# EAGLE board atari_superxe_motherboard (EAGLE 7.2.0), part 1 of 3
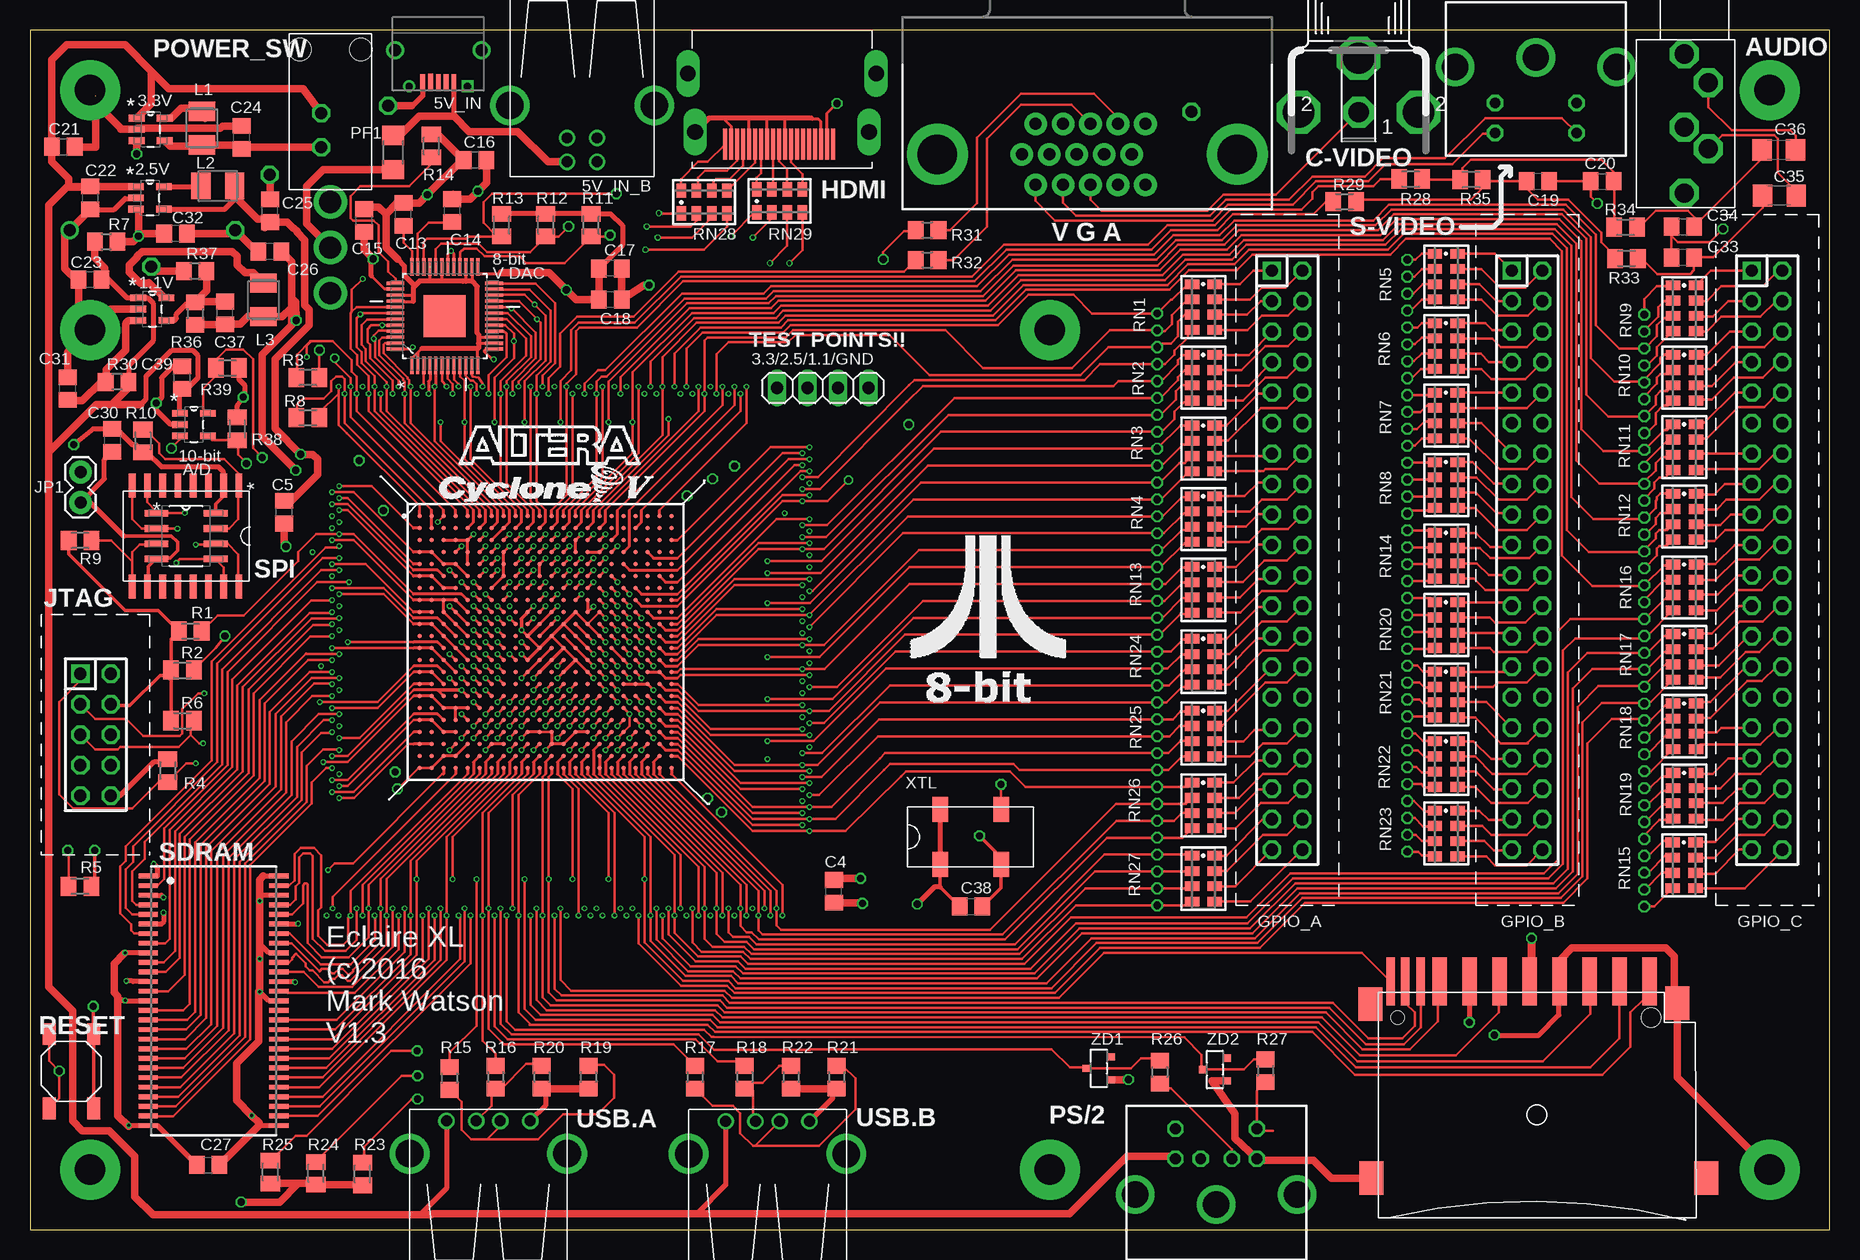
[diagram p12: board, top side]
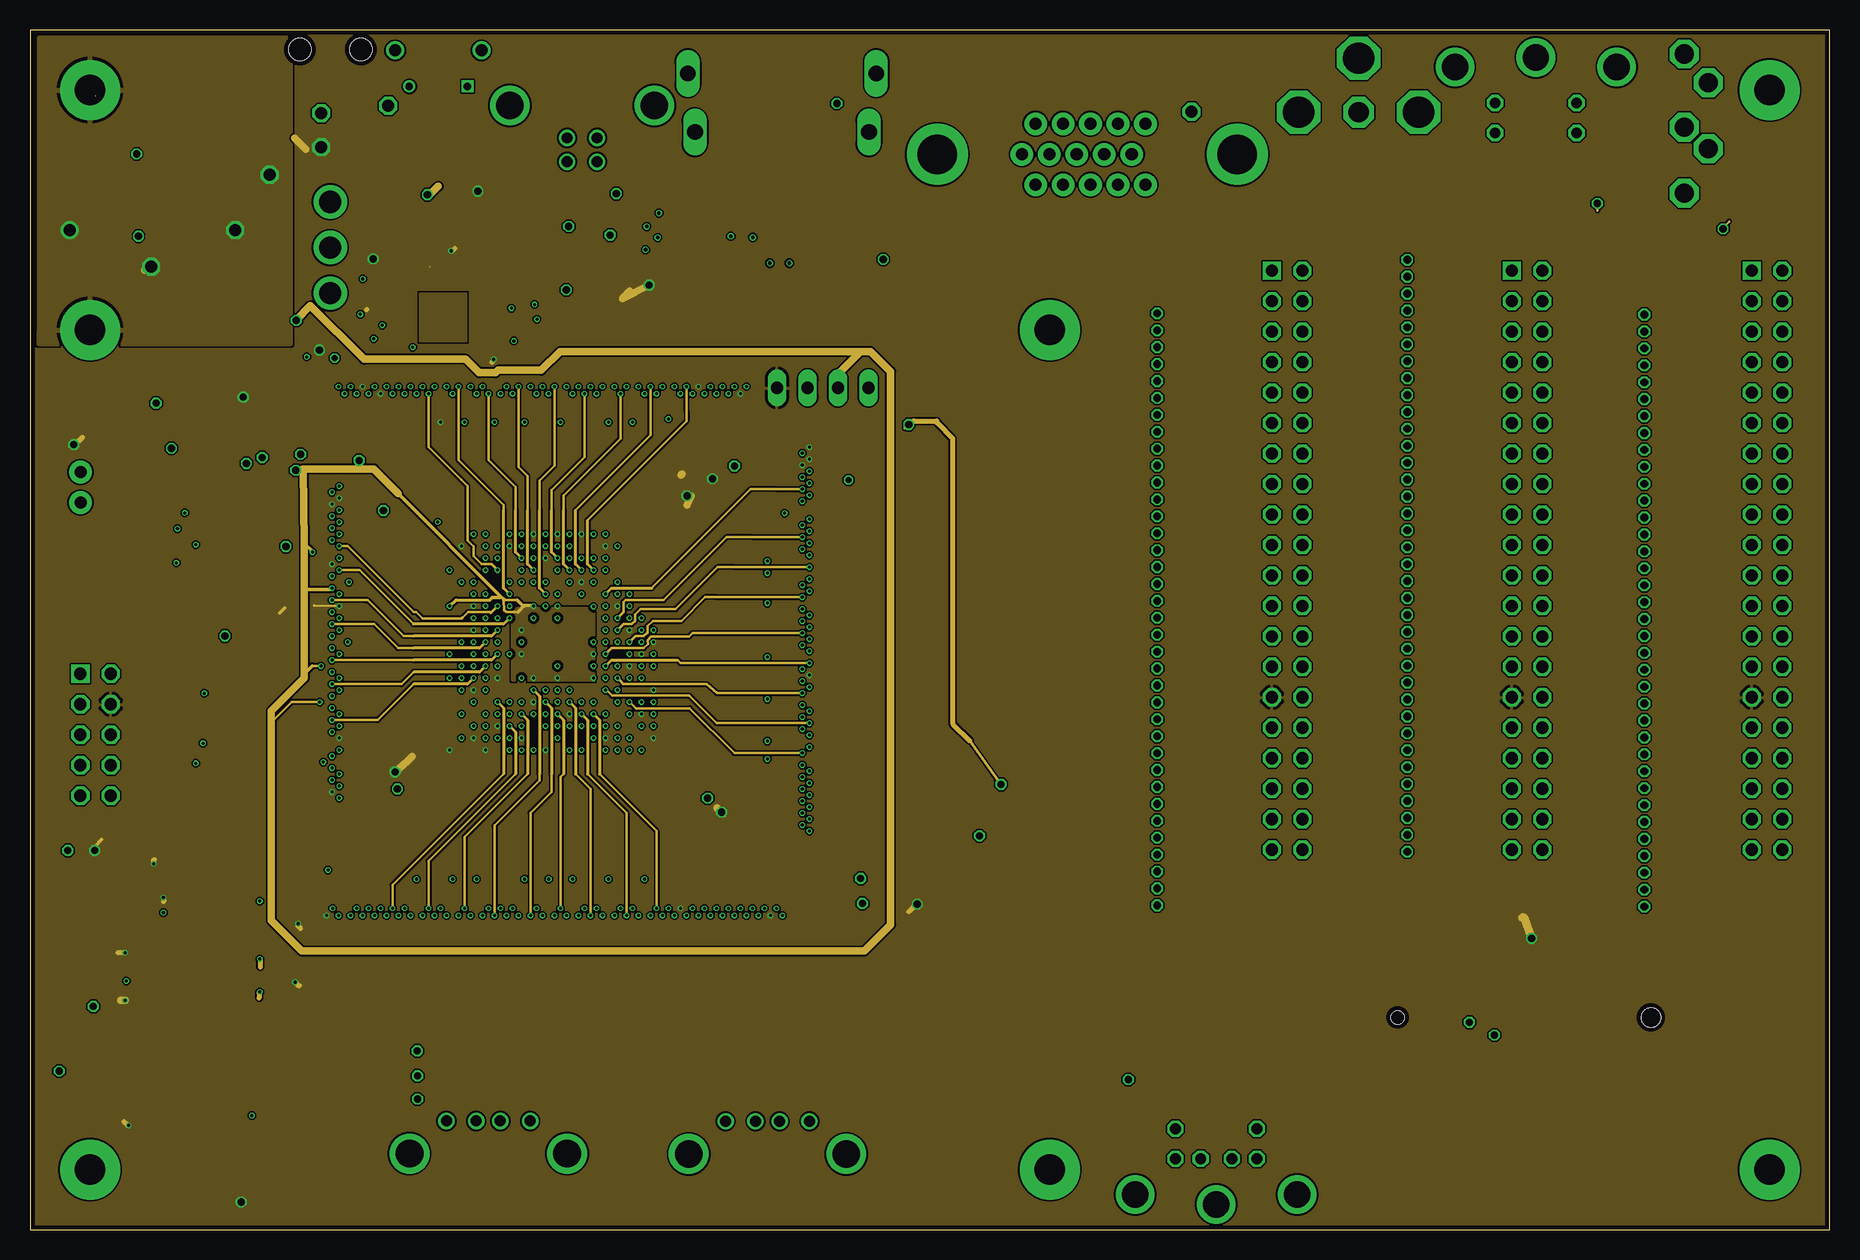
[diagram p13: board, inner layer Route2]
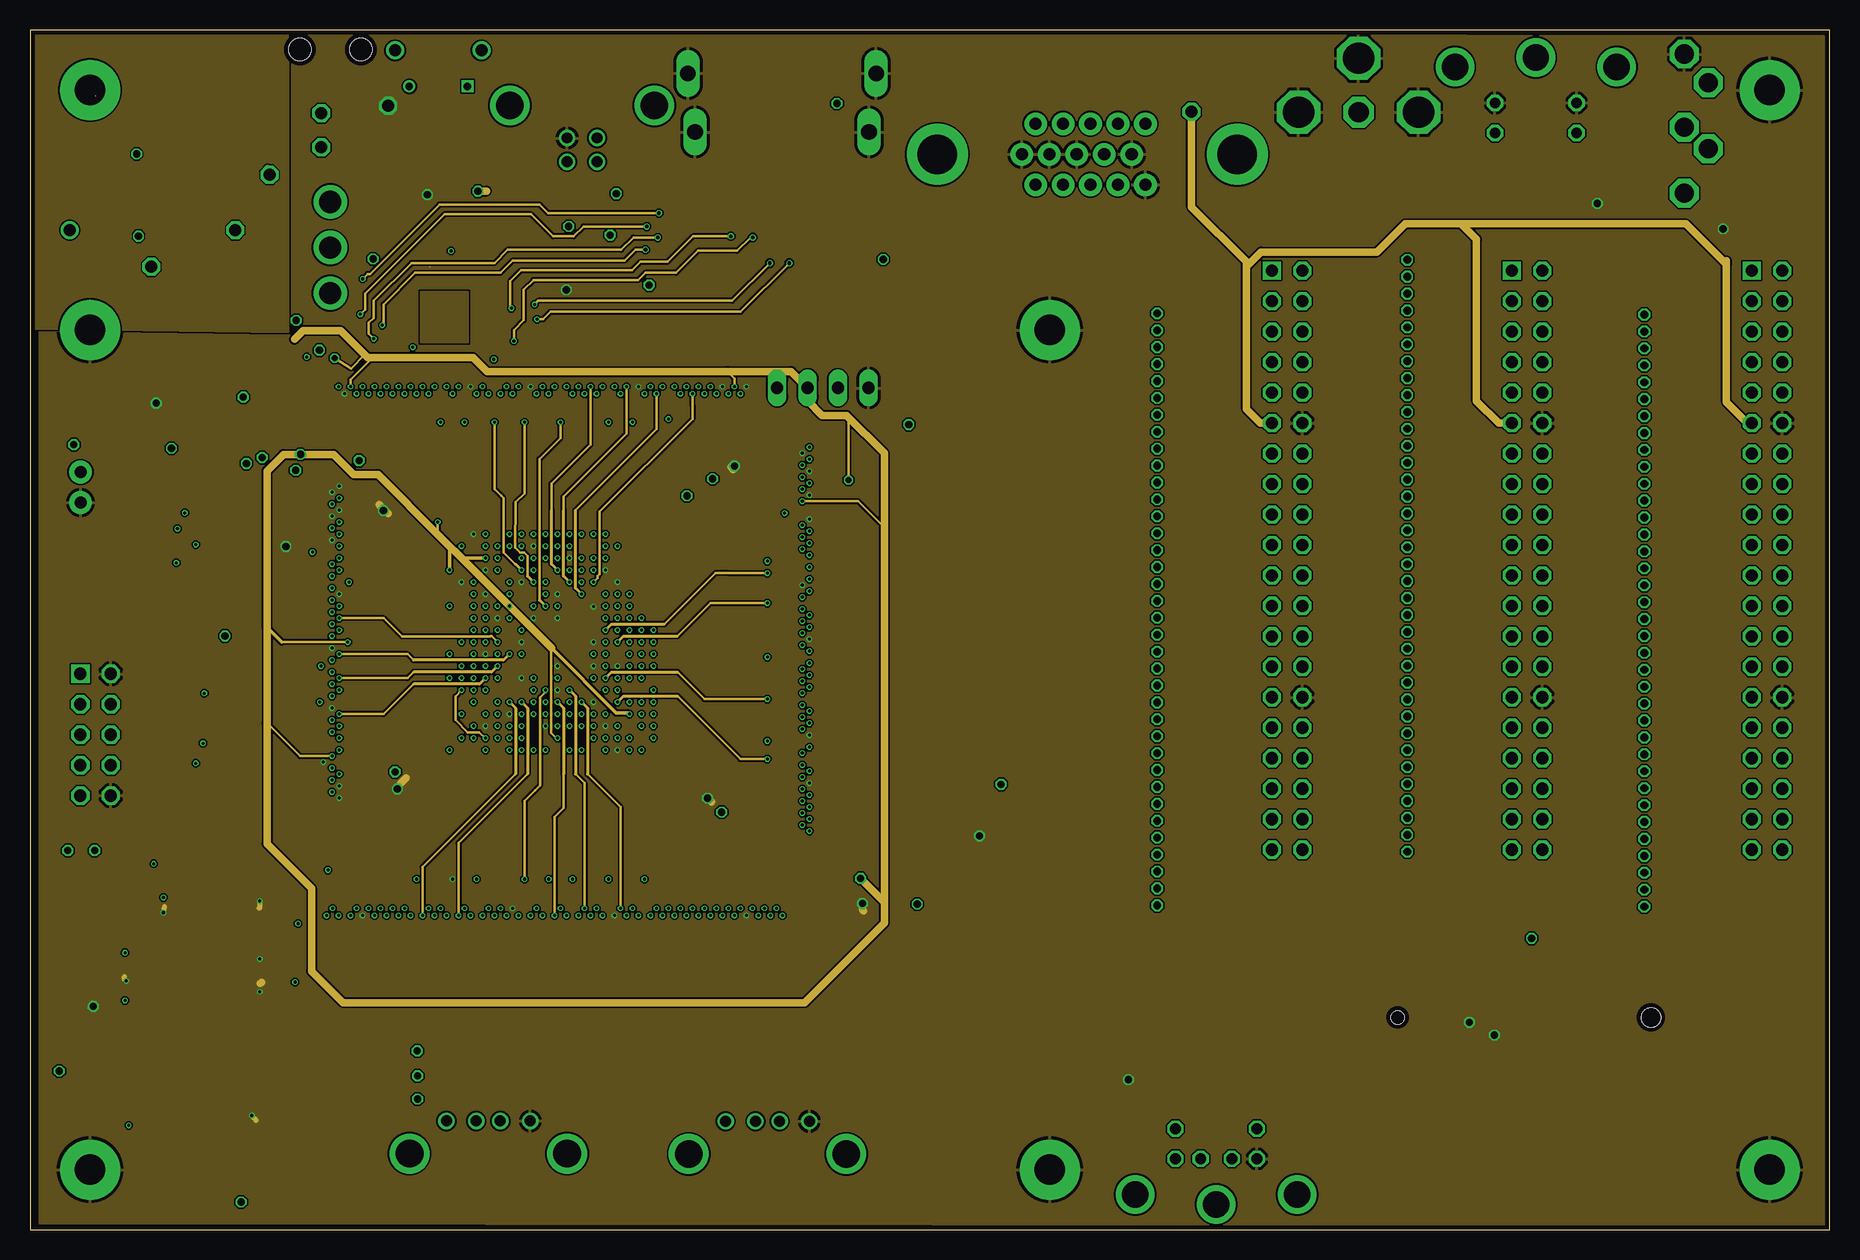
[diagram p14: board, inner layer Route15]
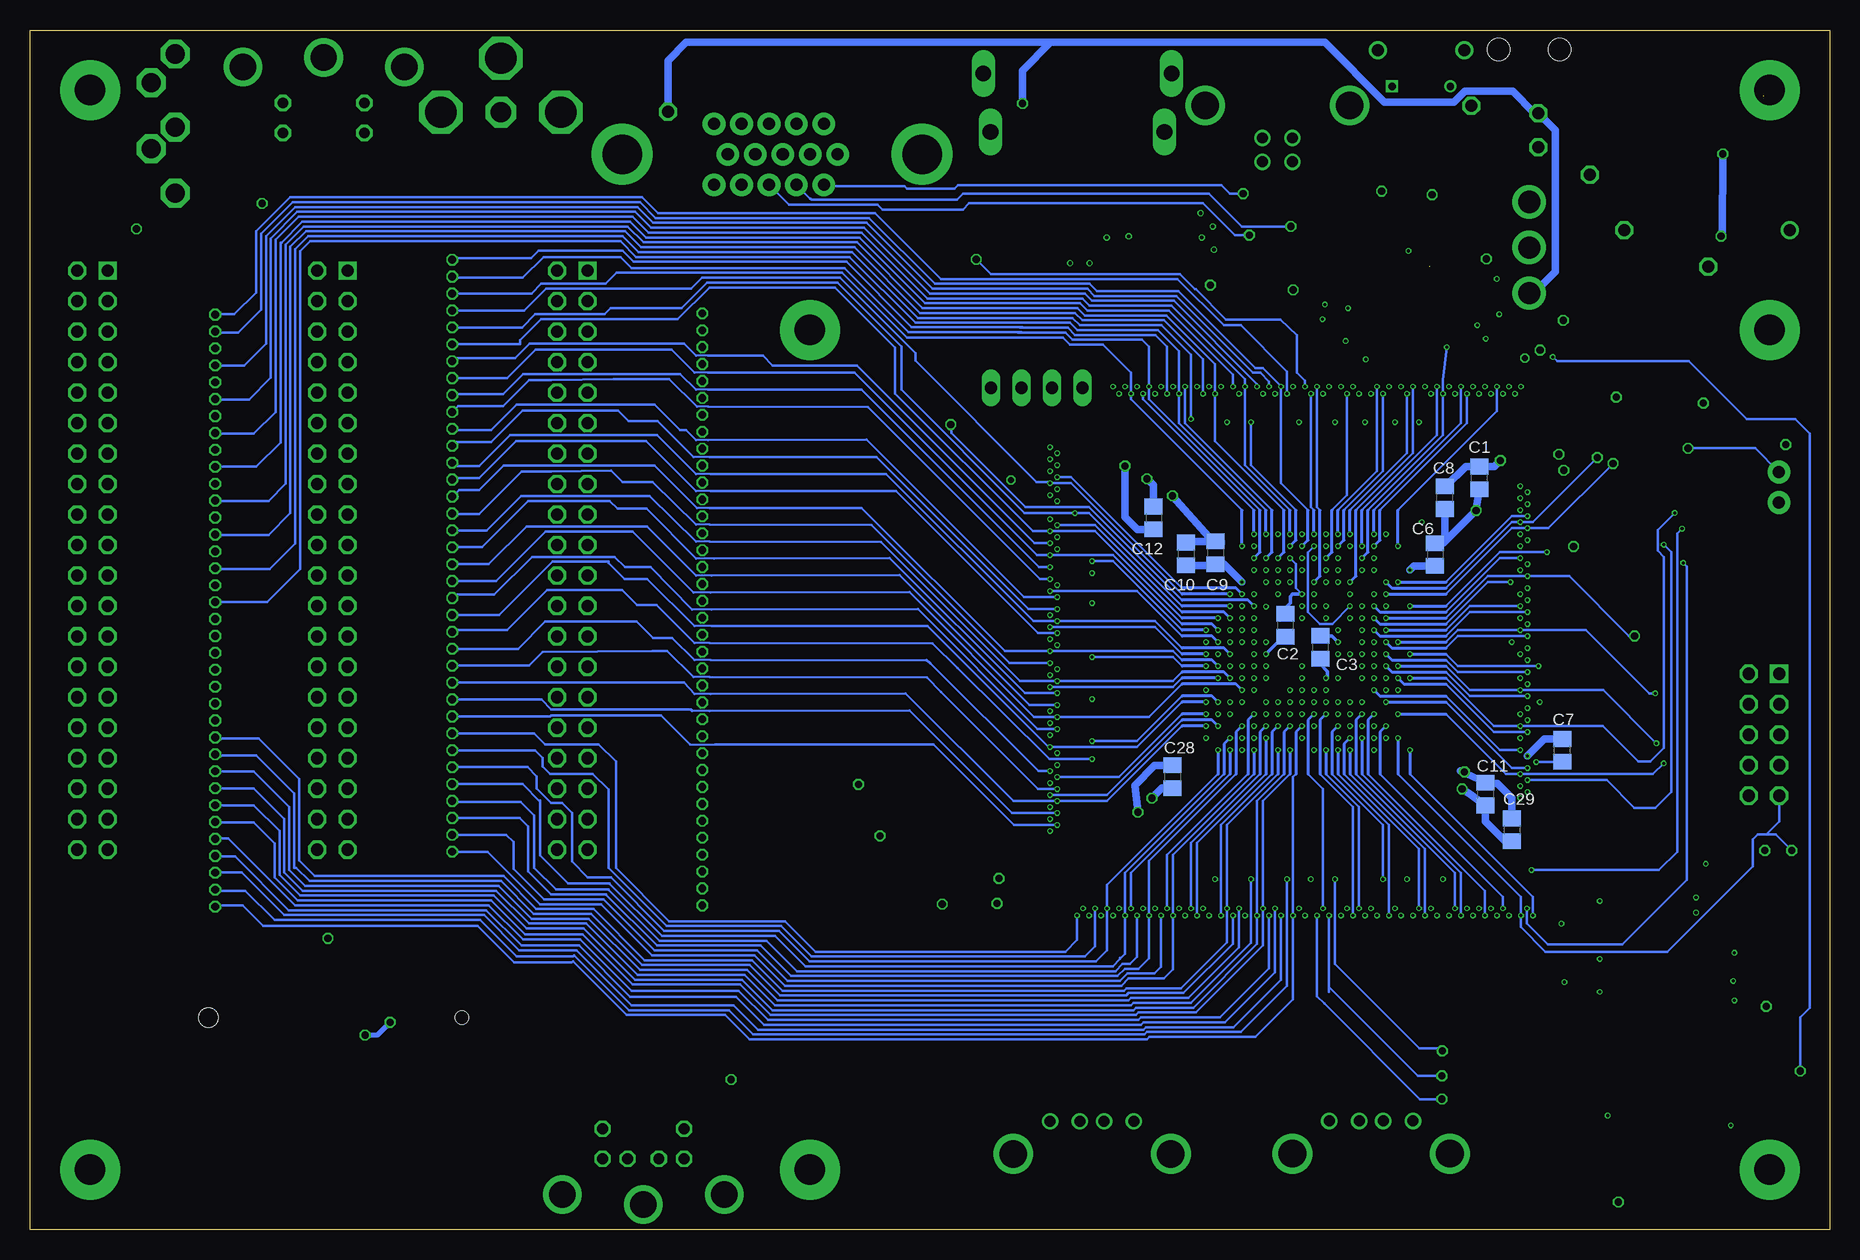
[diagram p15: board, bottom side, seen from below]

Size 150 x 100 mm. Coordinates in mm from the lower left corner, seen from the top.
Outline: 0,0 150,0 150,100 0,100 0,0
Copper layers (1*2*15*16): Top 0.035559375mm / dielectric 0.17018125mm / Route2 0.01778125mm / dielectric 47mil / Route15 0.01778125mm / dielectric 0.17018125mm / Bottom 0.035559375mm
Design rules "OSHPark-4layer *": minimum track width 5mil, minimum drill 10mil, track to track 5mil, track to pad 5mil, pad to pad 5mil, via to via 5mil, smd to smd 5mil, copper to edge 15mil, drill to drill 6mil, minimum pad ring 4mil, minimum via ring 4mil, stop-mask expansion 4mil, vias tented up to drill 10mil, thermal gap 10mil

## Footprints (pad centres in the part's own frame; a part is rotated, then mirrored left to right if it is on the bottom)
SOT95P280X145-5N = smd 1.321 x 0.559: 1 -1.168,0.94; 2 -1.168,0; 3 -1.168,-0.94; 4 1.168,-0.94; 5 1.168,0.94
1X04 = drill 1.016 long: 1 -3.81,0; 2 -1.27,0; 3 1.27,0; 4 3.81,0
ZX62D-B-5P8 = smd 0.4 x 1.35: P$1 -1.3,2.675; P$2 -0.65,2.675; P$3 0,2.675; P$4 0.65,2.675; P$5 1.3,2.675 | drill 0.6 pad 1 square: SH1 -2.425,3 | drill 0.6 pad 1: SH2 2.425,3 | drill 1 pad 1.4: SH3 -3.6,0; SH4 3.6,0
USB-B-H = drill 0.914: D+ 0,1.25; D- 1.981,1.25; GND 0,-1.25; VBUS 1.981,-1.25 | drill 2.286: P$1 -2.718,-6.02; P$2 -2.718,6.02
AUDIO-JACK-CUI-353X = drill 1.6 pad 2.3 octagon: P$1 -1.9,4.6; P$2 0.1,2.2; P$3 0.1,-3.3; P$4 -1.9,-7 | drill 1.6 pad 2.4 octagon: P$5 -1.9,-1.5
C0805 = smd 1.3 x 1.5: 1 -0.95,0; 2 0.95,0
C1206 = smd 1.6 x 1.8: 1 -1.4,0; 2 1.4,0
TOBU3_EXT = drill 1.702 octagon: 1 0,0 | drill 2.591 octagon: 2 5,0; 2@1 -5,0; 2@2 0,4.5
DIL-100-2X20 = drill 1.016 square: 1 -24.13,-1.27 | drill 1.016 octagon: 2 -24.13,1.27; 3 -21.59,-1.27; 4 -21.59,1.27; 5 -19.05,-1.27; 6 -19.05,1.27; 7 -16.51,-1.27; 8 -16.51,1.27; 9 -13.97,-1.27; 10 -13.97,1.27; 11 -11.43,-1.27; 12 -11.43,1.27; 13 -8.89,-1.27; 14 -8.89,1.27; 15 -6.35,-1.27; 16 -6.35,1.27; 17 -3.81,-1.27; 18 -3.81,1.27; 19 -1.27,-1.27; 20 -1.27,1.27; 21 1.27,-1.27; 22 1.27,1.27; 23 3.81,-1.27; 24 3.81,1.27; 25 6.35,-1.27; 26 6.35,1.27; 27 8.89,-1.27; 28 8.89,1.27; 29 11.43,-1.27; 30 11.43,1.27; 31 13.97,-1.27; 32 13.97,1.27; 33 16.51,-1.27; 34 16.51,1.27; 35 19.05,-1.27; 36 19.05,1.27; 37 21.59,-1.27; 38 21.59,1.27; 39 24.13,-1.27; 40 24.13,1.27
2,5-PAD = drill 2.527 pad 5: B2,8 0,0
HDMI = smd 0.3 x 2.6: 1 4.75,4; 2 4.25,4; 3 3.75,4; 4 3.25,4; 5 2.75,4; 6 2.25,4; 7 1.75,4; 8 1.25,4; 9 0.75,4; 10 0.25,4; 11 -0.25,4; 12 -0.75,4; 13 -1.25,4; 14 -1.75,4; 15 -2.25,4; 16 -2.75,4; 17 -3.25,4; 18 -3.75,4; 19 -4.25,4 | drill 1.3 long: P$1 7.25,3; P$2 -7.25,3; P$3 -7.85,-1.9; P$4 7.85,-1.9
1X02 = drill 1.016 pad 1.88: 1 0,0; 2 2.54,0
DIL-100-2X05-BRD = drill 1.016 square: 1 -5.08,-1.27 | drill 1.016 octagon: 2 -5.08,1.27; 3 -2.54,-1.27; 4 -2.54,1.27; 5 0,-1.27; 6 0,1.27; 7 2.54,-1.27; 8 2.54,1.27; 9 5.08,-1.27; 10 5.08,1.27
L3225M = smd 1.6 x 2.2: 1 -1.4,0; 2 1.4,0
R1206 = smd 1.6 x 1.803: 1 -1.422,0; 2 1.422,0
ROCKER_VERT_SPDT2 = drill 1.85: P$1 0,0; P$2 0,-3.81; P$3 0,-7.62 | hole 1.85: 2.54,12.7; -2.54,12.7
MDIN06SS = drill 0.9 octagon: 1 1.3,8.5; 2 -1.3,8.5; 3 3.4,8.5; 4 -3.4,8.5; 5 3.4,11; 6 -3.4,11 | drill 2.2: P$1 -6.75,5.51; P$2 -0.01,4.7; P$3 6.75,5.52
M0805 = smd 1.3 x 1.6: 1 -0.95,0; 2 0.95,0
R0805 = smd 1.3 x 1.5: 1 -0.95,0; 2 0.95,0
SW4-SMD-4.0X4.0X1.7MM = smd 1.8 x 1.1: 1 -3.1,1.85; 2 3.1,1.85; 3 -3.1,-1.85; 4 3.1,-1.85
743-8 = smd 0.8 x 1.2: 1 -1.905,-0.953; 2 -0.635,-0.953; 3 0.635,-0.953; 4 1.905,-0.953; 5 1.905,0.953; 6 0.635,0.953; 7 -0.635,0.953; 8 -1.905,0.953
MDIN04SS = drill 0.9 octagon: 1 3.4,8.5; 2 -3.4,8.5; 3 3.4,11; 4 -3.4,11 | drill 2.2: P$1 -6.74,5.5; P$2 0,4.71; P$3 6.74,5.5
TSOP54 = smd 0.4 x 1.6: 1 -10.4,-5.45; 2 -9.6,-5.45; 3 -8.8,-5.45; 4 -8,-5.45; 5 -7.2,-5.45; 6 -6.4,-5.45; 7 -5.6,-5.45; 8 -4.8,-5.45; 9 -4,-5.45; 10 -3.2,-5.45; 11 -2.4,-5.45; 12 -1.6,-5.45; 13 -0.8,-5.45; 14 0,-5.45; 15 0.8,-5.45; 16 1.6,-5.45; 17 2.4,-5.45; 18 3.2,-5.45; 19 4,-5.45; 20 4.8,-5.45; 21 5.6,-5.45; 22 6.4,-5.45; 23 7.2,-5.45; 24 8,-5.45; 25 8.8,-5.45; 26 9.6,-5.45; 27 10.4,-5.45; 28 10.4,5.45; 29 9.6,5.45; 30 8.8,5.45; 31 8,5.45; 32 7.2,5.45; 33 6.4,5.45; 34 5.6,5.45; 35 4.8,5.45; 36 4,5.45; 37 3.2,5.45; 38 2.4,5.45; 39 1.6,5.45; 40 0.8,5.45; 41 0,5.45; 42 -0.8,5.45; 43 -1.6,5.45; 44 -2.4,5.45; 45 -3.2,5.45; 46 -4,5.45; 47 -4.8,5.45; 48 -5.6,5.45; 49 -6.4,5.45; 50 -7.2,5.45; 51 -8,5.45; 52 -8.8,5.45; 53 -9.6,5.45; 54 -10.4,5.45
EPCS_BOTH = smd 1.981 x 0.559: 1 -2.464,1.905; 2 -2.464,0.635; 3 -2.464,-0.635; 4 -2.464,-1.905; 5 2.464,-1.905; 6 2.464,-0.635; 7 2.464,0.635; 8 2.464,1.905 | smd 0.559 x 1.981: L$1 4.41,4.21; L$2 3.14,4.21; L$3 1.87,4.21; L$4 0.6,4.21; L$5 -0.67,4.21; L$6 -1.94,4.21; L$7 -3.21,4.21; L$8 -4.48,4.21; L$9 -4.48,-4.21; L$10 -3.21,-4.21; L$11 -1.94,-4.21; L$12 -0.67,-4.21; L$13 0.6,-4.21; L$14 1.87,-4.21; L$15 3.14,-4.21; L$16 4.41,-4.21
CYCLONEVF484V2 = smd 0.38 x 0.38: A1 -10.5,10.5; A2 -9.5,10.5; A3 -8.5,10.5; A4 -7.5,10.5; A5 -6.5,10.5; A6 -5.5,10.5; A7 -4.5,10.5; A8 -3.5,10.5; A9 -2.5,10.5; A10 -1.5,10.5; A11 -0.5,10.5; A12 0.5,10.5; A13 1.5,10.5; A14 2.5,10.5; A15 3.5,10.5; A16 4.5,10.5; A17 5.5,10.5; A18 6.5,10.5; A19 7.5,10.5; A20 8.5,10.5; A21 9.5,10.5; A22 10.5,10.5; AA1 -10.5,-9.5; AA2 -9.5,-9.5; AA3 -8.5,-9.5; AA4 -7.5,-9.5; AA5 -6.5,-9.5; AA6 -5.5,-9.5; AA7 -4.5,-9.5; AA8 -3.5,-9.5; AA9 -2.5,-9.5; AA10 -1.5,-9.5; AA11 -0.5,-9.5; AA12 0.5,-9.5; AA13 1.5,-9.5; AA14 2.5,-9.5; AA15 3.5,-9.5; AA16 4.5,-9.5; AA17 5.5,-9.5; AA18 6.5,-9.5; AA19 7.5,-9.5; AA20 8.5,-9.5; AA21 9.5,-9.5; AA22 10.5,-9.5; AB1 -10.5,-10.5; AB2 -9.5,-10.5; AB3 -8.5,-10.5; AB4 -7.5,-10.5; AB5 -6.5,-10.5; AB6 -5.5,-10.5; AB7 -4.5,-10.5; AB8 -3.5,-10.5; AB9 -2.5,-10.5; AB10 -1.5,-10.5; AB11 -0.5,-10.5; AB12 0.5,-10.5; AB13 1.5,-10.5; AB14 2.5,-10.5; AB15 3.5,-10.5; AB16 4.5,-10.5; AB17 5.5,-10.5; AB18 6.5,-10.5; AB19 7.5,-10.5; AB20 8.5,-10.5; AB21 9.5,-10.5; AB22 10.5,-10.5; B1 -10.5,9.5; B2 -9.5,9.5; B3 -8.5,9.5; B4 -7.5,9.5; B5 -6.5,9.5; B6 -5.5,9.5; B7 -4.5,9.5; B8 -3.5,9.5; B9 -2.5,9.5; B10 -1.5,9.5; B11 -0.5,9.5; B12 0.5,9.5; B13 1.5,9.5; B14 2.5,9.5; B15 3.5,9.5; B16 4.5,9.5; B17 5.5,9.5; B18 6.5,9.5; B19 7.5,9.5; B20 8.5,9.5; B21 9.5,9.5; B22 10.5,9.5; C1 -10.5,8.5; C2 -9.5,8.5; C3 -8.5,8.5; C4 -7.5,8.5; C5 -6.5,8.5; C6 -5.5,8.5; C7 -4.5,8.5; C8 -3.5,8.5; C9 -2.5,8.5; C10 -1.5,8.5; C11 -0.5,8.5; C12 0.5,8.5; C13 1.5,8.5; C14 2.5,8.5; C15 3.5,8.5; C16 4.5,8.5; C17 5.5,8.5; C18 6.5,8.5; C19 7.5,8.5; C20 8.5,8.5; C21 9.5,8.5; C22 10.5,8.5; D1 -10.5,7.5; D2 -9.5,7.5; D3 -8.5,7.5; D4 -7.5,7.5; D5 -6.5,7.5; D6 -5.5,7.5; D7 -4.5,7.5; D8 -3.5,7.5; D9 -2.5,7.5; D10 -1.5,7.5; D11 -0.5,7.5; D12 0.5,7.5; D13 1.5,7.5; D14 2.5,7.5; D15 3.5,7.5; D16 4.5,7.5; D17 5.5,7.5; D18 6.5,7.5; D19 7.5,7.5; D20 8.5,7.5; D21 9.5,7.5; D22 10.5,7.5; E1 -10.5,6.5; E2 -9.5,6.5; E3 -8.5,6.5; E4 -7.5,6.5; E5 -6.5,6.5; E6 -5.5,6.5; E7 -4.5,6.5; E8 -3.5,6.5; E9 -2.5,6.5; E10 -1.5,6.5; E11 -0.5,6.5; E12 0.5,6.5; E13 1.5,6.5; E14 2.5,6.5; E15 3.5,6.5; E16 4.5,6.5; E17 5.5,6.5; E18 6.5,6.5; E19 7.5,6.5; E20 8.5,6.5; E21 9.5,6.5; E22 10.5,6.5; F1 -10.5,5.5; F2 -9.5,5.5; F3 -8.5,5.5; F4 -7.5,5.5; F5 -6.5,5.5; F6 -5.5,5.5; F7 -4.5,5.5; F8 -3.5,5.5; F9 -2.5,5.5; F10 -1.5,5.5; F11 -0.5,5.5; F12 0.5,5.5; F13 1.5,5.5; F14 2.5,5.5; F15 3.5,5.5; F16 4.5,5.5; F17 5.5,5.5; F18 6.5,5.5; F19 7.5,5.5; F20 8.5,5.5; F21 9.5,5.5; F22 10.5,5.5; G1 -10.5,4.5; G2 -9.5,4.5; G3 -8.5,4.5; G4 -7.5,4.5; G5 -6.5,4.5; G6 -5.5,4.5; G7 -4.5,4.5; G8 -3.5,4.5; G9 -2.5,4.5; G10 -1.5,4.5; G11 -0.5,4.5; G12 0.5,4.5; G13 1.5,4.5; G14 2.5,4.5; G15 3.5,4.5; G16 4.5,4.5; G17 5.5,4.5; G18 6.5,4.5; G19 7.5,4.5; G20 8.5,4.5; G21 9.5,4.5; G22 10.5,4.5; H1 -10.5,3.5; H2 -9.5,3.5; H3 -8.5,3.5; H4 -7.5,3.5; H5 -6.5,3.5; H6 -5.5,3.5; H7 -4.5,3.5; H8 -3.5,3.5; H9 -2.5,3.5; H10 -1.5,3.5; H11 -0.5,3.5; H12 0.5,3.5; H13 1.5,3.5; H14 2.5,3.5; H15 3.5,3.5; H16 4.5,3.5; H17 5.5,3.5; H18 6.5,3.5; H19 7.5,3.5; H20 8.5,3.5; H21 9.5,3.5; H22 10.5,3.5; J1 -10.5,2.5; J2 -9.5,2.5; J3 -8.5,2.5; J4 -7.5,2.5; J5 -6.5,2.5; J6 -5.5,2.5; J7 -4.5,2.5; J8 -3.5,2.5; J9 -2.5,2.5; J10 -1.5,2.5; J11 -0.5,2.5; J12 0.5,2.5; J13 1.5,2.5; J14 2.5,2.5; J15 3.5,2.5; J16 4.5,2.5; J17 5.5,2.5; J18 6.5,2.5; J19 7.5,2.5; J20 8.5,2.5; J21 9.5,2.5; J22 10.5,2.5; K1 -10.5,1.5; K2 -9.5,1.5; K3 -8.5,1.5; K4 -7.5,1.5; K5 -6.5,1.5; K6 -5.5,1.5; K7 -4.5,1.5; K8 -3.5,1.5; K9 -2.5,1.5; K10 -1.5,1.5; K11 -0.5,1.5; K12 0.5,1.5; K13 1.5,1.5; K14 2.5,1.5; K15 3.5,1.5; K16 4.5,1.5; K17 5.5,1.5; K18 6.5,1.5; K19 7.5,1.5; K20 8.5,1.5; K21 9.5,1.5; K22 10.5,1.5; L1 -10.5,0.5; L2 -9.5,0.5; L3 -8.5,0.5; L4 -7.5,0.5; L5 -6.5,0.5; L6 -5.5,0.5; L7 -4.5,0.5; L8 -3.5,0.5; L9 -2.5,0.5; L10 -1.5,0.5; L11 -0.5,0.5; L12 0.5,0.5; L13 1.5,0.5; L14 2.5,0.5; L15 3.5,0.5; L16 4.5,0.5; L17 5.5,0.5; L18 6.5,0.5; L19 7.5,0.5; L20 8.5,0.5; L21 9.5,0.5; L22 10.5,0.5; M1 -10.5,-0.5; M2 -9.5,-0.5; M3 -8.5,-0.5; M4 -7.5,-0.5; M5 -6.5,-0.5; M6 -5.5,-0.5; M7 -4.5,-0.5; M8 -3.5,-0.5; M9 -2.5,-0.5; M10 -1.5,-0.5; M11 -0.5,-0.5; M12 0.5,-0.5; M13 1.5,-0.5; M14 2.5,-0.5; M15 3.5,-0.5; M16 4.5,-0.5; M17 5.5,-0.5; M18 6.5,-0.5; M19 7.5,-0.5; M20 8.5,-0.5; M21 9.5,-0.5; M22 10.5,-0.5; N1 -10.5,-1.5; N2 -9.5,-1.5; N3 -8.5,-1.5; N4 -7.5,-1.5; N5 -6.5,-1.5; N6 -5.5,-1.5; N7 -4.5,-1.5; N8 -3.5,-1.5; N9 -2.5,-1.5; N10 -1.5,-1.5; N11 -0.5,-1.5; N12 0.5,-1.5; N13 1.5,-1.5; N14 2.5,-1.5; N15 3.5,-1.5; N16 4.5,-1.5; N17 5.5,-1.5; N18 6.5,-1.5; N19 7.5,-1.5; N20 8.5,-1.5; N21 9.5,-1.5; N22 10.5,-1.5; P1 -10.5,-2.5; P2 -9.5,-2.5; P3 -8.5,-2.5; P4 -7.5,-2.5; P5 -6.5,-2.5; P6 -5.5,-2.5; P7 -4.5,-2.5; P8 -3.5,-2.5; P9 -2.5,-2.5; P10 -1.5,-2.5; P11 -0.5,-2.5; P12 0.5,-2.5; P13 1.5,-2.5; P14 2.5,-2.5; P15 3.5,-2.5; P16 4.5,-2.5; P17 5.5,-2.5; P18 6.5,-2.5; P19 7.5,-2.5; P20 8.5,-2.5; P21 9.5,-2.5; P22 10.5,-2.5; R1 -10.5,-3.5; R2 -9.5,-3.5; R3 -8.5,-3.5; R4 -7.5,-3.5; R5 -6.5,-3.5; R6 -5.5,-3.5; R7 -4.5,-3.5; R8 -3.5,-3.5; R9 -2.5,-3.5; R10 -1.5,-3.5; R11 -0.5,-3.5; R12 0.5,-3.5; R13 1.5,-3.5; R14 2.5,-3.5; R15 3.5,-3.5; R16 4.5,-3.5; R17 5.5,-3.5; R18 6.5,-3.5; R19 7.5,-3.5; R20 8.5,-3.5; R21 9.5,-3.5; R22 10.5,-3.5; T1 -10.5,-4.5; T2 -9.5,-4.5; T3 -8.5,-4.5; T4 -7.5,-4.5; T5 -6.5,-4.5; T6 -5.5,-4.5; T7 -4.5,-4.5; T8 -3.5,-4.5; T9 -2.5,-4.5; T10 -1.5,-4.5; T11 -0.5,-4.5; T12 0.5,-4.5; T13 1.5,-4.5; T14 2.5,-4.5; T15 3.5,-4.5; T16 4.5,-4.5; T17 5.5,-4.5; T18 6.5,-4.5; T19 7.5,-4.5; T20 8.5,-4.5; T21 9.5,-4.5; T22 10.5,-4.5; U1 -10.5,-5.5; U2 -9.5,-5.5; U3 -8.5,-5.5; U4 -7.5,-5.5; U5 -6.5,-5.5; U6 -5.5,-5.5; U7 -4.5,-5.5; U8 -3.5,-5.5; U9 -2.5,-5.5; U10 -1.5,-5.5; U11 -0.5,-5.5; U12 0.5,-5.5; U13 1.5,-5.5; U14 2.5,-5.5; U15 3.5,-5.5; U16 4.5,-5.5; U17 5.5,-5.5; U18 6.5,-5.5; U19 7.5,-5.5; U20 8.5,-5.5; U21 9.5,-5.5; U22 10.5,-5.5; V1 -10.5,-6.5; V2 -9.5,-6.5; V3 -8.5,-6.5; V4 -7.5,-6.5; V5 -6.5,-6.5; V6 -5.5,-6.5; V7 -4.5,-6.5; V8 -3.5,-6.5; V9 -2.5,-6.5; V10 -1.5,-6.5; V11 -0.5,-6.5; V12 0.5,-6.5; V13 1.5,-6.5; V14 2.5,-6.5; V15 3.5,-6.5; V16 4.5,-6.5; V17 5.5,-6.5; V18 6.5,-6.5; V19 7.5,-6.5; V20 8.5,-6.5; V21 9.5,-6.5; V22 10.5,-6.5; W1 -10.5,-7.5; W2 -9.5,-7.5; W3 -8.5,-7.5; W4 -7.5,-7.5; W5 -6.5,-7.5; W6 -5.5,-7.5; W7 -4.5,-7.5; W8 -3.5,-7.5; W9 -2.5,-7.5; W10 -1.5,-7.5; W11 -0.5,-7.5; W12 0.5,-7.5; W13 1.5,-7.5; W14 2.5,-7.5; W15 3.5,-7.5; W16 4.5,-7.5; W17 5.5,-7.5; W18 6.5,-7.5; W19 7.5,-7.5; W20 8.5,-7.5; W21 9.5,-7.5; W22 10.5,-7.5; Y1 -10.5,-8.5; Y2 -9.5,-8.5; Y3 -8.5,-8.5; Y4 -7.5,-8.5; Y5 -6.5,-8.5; Y6 -5.5,-8.5; Y7 -4.5,-8.5; Y8 -3.5,-8.5; Y9 -2.5,-8.5; Y10 -1.5,-8.5; Y11 -0.5,-8.5; Y12 0.5,-8.5; Y13 1.5,-8.5; Y14 2.5,-8.5; Y15 3.5,-8.5; Y16 4.5,-8.5; Y17 5.5,-8.5; Y18 6.5,-8.5; Y19 7.5,-8.5; Y20 8.5,-8.5; Y21 9.5,-8.5; Y22 10.5,-8.5
HALFHEIGHTSD = smd 1.2 x 4: 1 6.9,11.06; 2 4.4,11.06; 3 1.9,11.06; 4 -0.6,11.06; 5 -3.1,11.06; 6 -5.6,11.06; 7 -8.1,11.06; 9 9.4,11.06 | smd 0.7 x 4: 8 -9.7,11.06; CD -11,11.06; WP -12.2,11.06 | smd 2 x 2.8: GP -13.8,-5.34; GP2 14.1,-5.34; GP3 11.7,9.26; GP4 -13.9,9.16 | hole 1.1: -11.6,8.06 | hole 1.6: 9.5,8.06
HDR_141_36 = drill 0.65 octagon: P$1 -25.38,0; P$2 -23.97,0; P$3 -22.56,0; P$4 -21.15,0; P$5 -19.74,0; P$6 -18.33,0; P$7 -16.92,0; P$8 -15.51,0; P$9 -14.1,0; P$10 -12.69,0; P$11 -11.28,0; P$12 -9.87,0; P$13 -8.46,0; P$14 -7.05,0; P$15 -5.64,0; P$16 -4.23,0; P$17 -2.82,0; P$18 -1.41,0; P$19 0,0; P$20 1.41,0; P$21 2.82,0; P$22 4.23,0; P$23 5.64,0; P$24 7.05,0; P$25 8.46,0; P$26 9.87,0; P$27 11.28,0; P$28 12.69,0; P$29 14.1,0; P$30 15.51,0; P$31 16.92,0; P$32 18.33,0; P$33 19.74,0; P$34 21.15,0; P$35 22.56,0; P$36 23.97,0
USB-A-H = drill 0.914: D+ 2.718,-1.003; D- 2.718,1.003; GND 2.718,-3.493; VBUS 2.718,3.493 | drill 2.311: P$5 0,-6.566; P$6 0,6.566
DB15 = drill 1.016 pad 1.88: 1 -4.32,-7.62; 2 -2.03,-7.62; 3 0.26,-7.62; 4 2.55,-7.62; 5 4.84,-7.62; 6 -5.46,-5.08; 7 -3.17,-5.08; 8 -0.88,-5.08; 9 1.41,-5.08; 10 3.7,-5.08; 11 -4.32,-2.54; 12 -2.03,-2.54; 13 0.26,-2.54; 14 2.55,-2.54; 15 4.84,-2.54 | drill 3.302 pad 5.08: G1 -12.5,-5.08; G2 12.5,-5.08
QFP50P900X900X120-49N = smd 1.473 x 0.279: 1 -4.115,2.743; 2 -4.115,2.261; 3 -4.115,1.753; 4 -4.115,1.245; 5 -4.115,0.762; 6 -4.115,0.254; 7 -4.115,-0.254; 8 -4.115,-0.762; 9 -4.115,-1.245; 10 -4.115,-1.753; 11 -4.115,-2.261; 12 -4.115,-2.743; 25 4.115,-2.743; 26 4.115,-2.261; 27 4.115,-1.753; 28 4.115,-1.245; 29 4.115,-0.762; 30 4.115,-0.254; 31 4.115,0.254; 32 4.115,0.762; 33 4.115,1.245; 34 4.115,1.753; 35 4.115,2.261; 36 4.115,2.743 | smd 0.279 x 1.473: 13 -2.743,-4.115; 14 -2.261,-4.115; 15 -1.753,-4.115; 16 -1.245,-4.115; 17 -0.762,-4.115; 18 -0.254,-4.115; 19 0.254,-4.115; 20 0.762,-4.115; 21 1.245,-4.115; 22 1.753,-4.115; 23 2.261,-4.115; 24 2.743,-4.115; 37 2.743,4.115; 38 2.261,4.115; 39 1.753,4.115; 40 1.245,4.115; 41 0.762,4.115; 42 0.254,4.115; 43 -0.254,4.115; 44 -0.762,4.115; 45 -1.245,4.115; 46 -1.753,4.115; 47 -2.261,4.115; 48 -2.743,4.115 | smd 3.505 x 3.505: 49 0,0
SG-636 = smd 1.3 x 2.1: P$1 -2.54,-2.3; P$2 2.54,-2.3; P$3 2.54,2.3; P$4 -2.54,2.3
SOT23-R = smd 0.6 x 0.7: 1 -0.95,-1; 2 0.95,-1; 3 0,1

## Placement (x,y rotation side)
1.1V  1.1V  [SOT95P280X145-5N]  10.2,76.73 0 top
2.5V  2.5V  [SOT95P280X145-5N]  10,86 0 top
3.3/2.5/1.1/GND  [1X04]  66.08,70.16 0 top
3.3V  3.3V  [SOT95P280X145-5N]  10.05,91.71 0 top
5V_IN  ZX62D-B-5P8  [ZX62D-B-5P8]  34.04,98.3 180 top
5V_IN_B  [USB-B-H]  46.02,91 270 top
ADC  MCP3021  [SOT95P280X145-5N]  13.67,67.11 0 top
AUDIO  AUDIO-JACK2CUI  [AUDIO-JACK-CUI-353X]  139.8,93.39 0 top
C1  10uF  [C0805]  29.17,62.65 90 bottom
C2  0.047uF  [C0805]  45.37,50.38 270 bottom
C3  0.047uF  [C0805]  42.45,48.55 270 bottom
C4  SP  [C0805]  67.01,28.19 90 top
C5  2.2uF  [C0805]  21.2,59.81 90 top
C6  0.022uF  [C0805]  32.88,56.27 270 bottom
C7  0.0047uF  [C0805]  22.27,39.94 90 bottom
C8  SP  [C0805]  32.05,61.01 90 bottom
C9  10uF  [C0805]  51.19,56.42 270 bottom
C10  0.022uF  [C0805]  53.66,56.32 270 bottom
C11  0.022uF  [C0805]  28.69,36.31 270 bottom
C12  0.01uF  [C0805]  56.34,59.32 270 bottom
C13  0.1uF  [C0805]  31.13,84.62 90 top
C14  0.1uF  [C0805]  35.17,84.95 270 top
C15  10uF  [C0805]  27.85,84.11 90 top
C16  0.1uF  [C0805]  37.1,89.14 180 top
C17  0.1uF  [C0805]  48.37,80.12 180 top
C18  0.01uF  [C0805]  48.37,77.51 180 top
C19  10nF  [C0805]  125.69,87.41 0 top
C20  10nF  [C0805]  131.04,87.38 0 top
C21  10uF  [C0805]  2.78,90.26 0 top
C22  10uF  [C0805]  5,86 270 top
C23  10uF  [C0805]  5.01,79.17 180 top
C24  22uF  [C0805]  17.65,91.05 90 top
C25  22uF  [C0805]  20,84.93 90 top
C26  22uF  [C0805]  19.99,81.52 180 top
C27  0.1uF  [C0805]  14.85,5.38 0 top
C28  0.01uF  [C0805]  54.76,37.74 270 bottom
C29  SP  [C0805]  26.47,33.32 270 bottom
C30  0.1uF  [C0805]  6.86,65.79 270 top
C31  10uF  [C0805]  3.15,70.1 90 top
C32  10uF  [C0805]  12.14,83.01 180 top
C33  10nF  [C0805]  137.77,81.03 180 top
C34  10nF  [C0805]  137.77,83.62 0 top
C35  100uF  [C1206]  145.82,86.18 180 top
C36  100uF  [C1206]  145.77,89.99 180 top
C37  15pF  [C0805]  16.26,76.4 90 top
C38  0.1uF  [C0805]  78.44,26.92 0 top
C39  0.1uF  [C0805]  12.7,71.02 90 top
C-VIDEO  TOBU3MINE  [TOBU3_EXT]  110.75,93.15 0 top
GPIO_A  DE1_GPIO  [DIL-100-2X20]  104.8,55.8 270 top
GPIO_B  DE1_GPIO  [DIL-100-2X20]  124.8,55.8 270 top
GPIO_C  DE1_GPIO  [DIL-100-2X20]  144.8,55.8 270 top
H1  MOUNT-PAD-ROUND2.5  [2,5-PAD]  145,95 0 top
H2  MOUNT-PAD-ROUND2.5  [2,5-PAD]  85,75 0 top
H3  MOUNT-PAD-ROUND2.5  [2,5-PAD]  85,5 0 top
H4  MOUNT-PAD-ROUND2.5  [2,5-PAD]  5,5 0 top
H5  MOUNT-PAD-ROUND2.5  [2,5-PAD]  5,75 0 top
H6  MOUNT-PAD-ROUND2.5  [2,5-PAD]  145,5 0 top
H7  MOUNT-PAD-ROUND2.5  [2,5-PAD]  5,95 0 top
HDMI  HDMI  [HDMI]  62.69,94.49 180 top
JP1  [1X02]  4.22,63.14 270 top
JTAG  M-2X05-BORDER  [DIL-100-2X05-BRD]  5.47,41.25 270 top
L1  1uH  [L3225M]  14.34,91.82 270 top
L2  1uH  [L3225M]  15.65,86.98 0 top
L3  1uH  [L3225M]  19.47,77.49 270 top
PF1  1A  [R1206]  30.28,89.79 270 top
POWER_SW  450302014072ROCKER2  [ROCKER_VERT_SPDT2]  25.03,85.67 0 top
PS/2  [MDIN06SS]  98.88,-2.6 0 top
R1  10k  [M0805]  13.36,49.89 180 top
R2  10k  [M0805]  12.7,46.63 180 top
R3  10k  [M0805]  23.16,71.02 0 top
R4  1k  [M0805]  11.48,38.25 90 top
R5  1k-10k  [M0805]  4.17,28.6 0 top
R6  1k-10k  [M0805]  12.7,42.42 180 top
R7  4k7  [R0805]  6.35,82.35 0 top
R8  2K 1%  [M0805]  23.16,67.68 180 top
R9  4.7k  [M0805]  4.18,57.44 0 top
R10  4.7k  [M0805]  9.42,65.74 90 top
R11  75  [M0805]  46.78,83.73 270 top
R12  75  [M0805]  42.99,83.73 270 top
R13  75  [M0805]  39.31,83.73 270 top
R14  348  [M0805]  33.47,90.33 270 top
R15  22  [R0805]  34.97,12.6 270 top
R16  22  [R0805]  38.8,12.7 270 top
R17  22  [R0805]  55.44,12.7 270 top
R18  22  [R0805]  59.58,12.7 270 top
R19  15k  [R0805]  46.55,12.7 270 top
R20  15k  [R0805]  42.66,12.7 270 top
R21  15k  [R0805]  67.22,12.7 270 top
R22  15k  [R0805]  63.44,12.7 270 top
R23  47K  [M0805]  27.72,4.64 270 top
R24  47K  [M0805]  23.83,4.69 270 top
R25  47K  [M0805]  20.05,4.79 270 top
R26  1k  [R0805]  94.17,13.13 270 top
R27  1k  [R0805]  102.99,13.23 270 top
R28  560  [M0805]  115.08,87.58 180 top
R29  560  [M0805]  109.58,85.68 180 top
R30  1k  [R0805]  7.26,70.66 180 top
R31  100  [R0805]  74.78,83.31 0 top
R32  100  [R0805]  74.78,80.82 0 top
R33  560  [M0805]  133.07,80.95 180 top
R34  560  [M0805]  132.99,83.57 180 top
R35  1k  [M0805]  120.14,87.53 0 top
R36  240  [R0805]  13.77,76.35 270 top
R37  200  [R0805]  13.77,79.91 0 top
R38  2k  [M0805]  17.27,66.75 90 top
R39  2k  [M0805]  16.46,71.83 180 top
RESET  [SW4-SMD-4.0X4.0X1.7MM]  3.45,13.21 90 top
RN1  47  [743-8]  97.81,76.9 270 top
RN2  47  [743-8]  97.81,71.01 270 top
RN3  47  [743-8]  97.81,65.12 270 top
RN4  47  [743-8]  97.81,59.22 270 top
RN5  47  [743-8]  118.05,79.44 270 top
RN6  47  [743-8]  118.05,73.65 270 top
RN7  47  [743-8]  118.05,67.86 270 top
RN8  47  [743-8]  118.05,62.07 270 top
RN9  47  [743-8]  137.91,76.8 270 top
RN10  47  [743-8]  137.91,71.01 270 top
RN11  47  [743-8]  137.91,65.22 270 top
RN12  47  [743-8]  137.91,59.43 270 top
RN13  47  [743-8]  97.81,53.33 270 top
RN14  47  [743-8]  118.05,56.18 270 top
RN15  47  [743-8]  137.88,30.37 270 top
RN16  47  [743-8]  137.91,53.53 270 top
RN17  47  [743-8]  137.91,47.74 270 top
RN18  47  [743-8]  137.91,41.95 270 top
RN19  47  [743-8]  137.91,36.16 270 top
RN20  47  [743-8]  118.05,50.38 270 top
RN21  47  [743-8]  118.05,44.59 270 top
RN22  47  [743-8]  118.05,38.8 270 top
RN23  47  [743-8]  118.05,33.01 270 top
RN24  47  [743-8]  97.81,47.34 270 top
RN25  47  [743-8]  97.81,41.34 270 top
RN26  47  [743-8]  97.81,35.35 270 top
RN27  47  [743-8]  97.81,29.25 270 top
RN28  270  [743-8]  56.18,85.65 0 top
RN29  270  [743-8]  62.48,85.75 0 top
S-VIDEO  [MDIN04SS]  125.52,102.42 180 top
SDRAM  K4S561632E-TC  [TSOP54]  15.3,19.07 270 top
SPI  EPCS  [EPCS_BOTH]  13,57.81 0 top
U$1  CYCLONEVFPGA484SMALLPINS  [CYCLONEVF484V2]  42.98,48.97 0 top
U$2  SDMMCHALFHEIGHT  [HALFHEIGHTSD]  125.61,9.62 0 top
U$3  HDR_SMALL_36_DEV_LALIGNED  [HDR_141_36]  134.56,50.89 270 top
U$4  HDR_SMALL_36_DEV_LALIGNED  [HDR_141_36]  114.8,55.46 270 top
U$5  HDR_SMALL_36_DEV_LALIGNED  [HDR_141_36]  93.95,50.99 270 top
USB.A  [USB-A-H]  38.2,6.33 90 top
USB.B  [USB-A-H]  61.48,6.3 90 top
VGA  DB15  [DB15]  88.14,94.72 0 top
VIDEODACSA  CDK3405  [QFP50P900X900X120-49N]  34.58,76.15 90 top
XTL  5MHz  [SG-636]  78.4,32.73 0 top
ZD1  [SOT23-R]  89.09,13.44 90 top
ZD2  [SOT23-R]  98.77,13.34 90 top

## Tracks (layer width: path | path; a pad name or v marks a point on that pad's centre or on a via)
1V1  (via drill 0.25 pad 0.46, 0.6)
  Top 0.2: 31.98,46.97 28.98,43.97 v24.15,43.97 | 31.98,50.97 29.48,53.47 v25.18,53.47
  Top 0.203: U$1.K15 U$1.J16
  Top 0.25: U$1.P13 v43.98,45.97 | U$1.N4 v34.98,47.97 | U$1.K13 U$1.L14 U$1.M15 v46.98,47.97 | v34.98,51.97 U$1.J4 U$1.K5 | U$1.K11 U$1.J12 v43.98,51.97 | U$1.P3 33.98,46.97 31.98,46.97 | U$1.N10 v40.98,47.97 | v41.98,45.97 U$1.P11 U$1.N12 | 31.98,50.97 33.98,50.97 U$1.K3 U$1.L4 | v46.98,45.97 U$1.P15 U$1.N14 U$1.M13 U$1.L12 | U$1.J14 U$1.K15 U$1.L16 v47.98,48.97 | U$1.J16 v47.98,50.97 | U$1.J10 v41.98,51.97 | v40.98,49.97 U$1.L10 U$1.M11
  Top 0.305: U$1.K11 U$1.L10 | U$1.J10 41.48,51.43 40.95,50.9 40.98,50.87 v40.98,49.97 40.95,49.94 | U$1.J14 U$1.K13 U$1.L12 U$1.M11 U$1.N10 | U$1.N14 U$1.P13 | U$1.P11 U$1.M13
  Top 0.61: v22.15,63.3 19.36,66.09 19.36,72.95 21.79,75.39 21.79,76.86 | R36.2 13.82,75.45 C37.1 16.29,75.49 17.53,75.49 18.18,76.14 19.42,76.14 L3.2 | 19.36,76 L3.2 | C26.1 21.79,80.67 21.79,76.86 | L3.2 21.02,76.09 21.79,76.86 | v22.2,75.79 22.15,77.32 21.84,77.62
  Route2 0.203: v24.25,46.97 23.5,46.97 | 39.52,51.61 39.73,51.46 40.69,51.46 | v24.15,43.97 21.82,43.97 20.12,42.27
  Route2 0.229: 39.52,51.61 39.47,52.48 40.59,52.48
  Route2 0.254: 35.53,52.48 38.3,52.48
  Route2 0.305: 30.68,61.37 39.24,52.76 | 39.24,52.76 39.47,52.58 39.47,52.48 | 41.15,52.02 41.2,52.02 | 41.2,52.02 41.93,52.02 v41.98,51.97 | 35.53,52.48 v34.98,51.97 | 23.5,46.97 22.86,46.33 | 22.86,53.34 25.05,53.34 v25.18,53.47 | 23.47,56.59 22.86,57.2 | 38.3,52.48 38.51,52.68 39.17,52.68 39.24,52.76 | 40.69,51.46 41.2,52.02 | 40.59,52.48 41.15,51.92
  Route2 0.61: v22.15,63.3 22.35,63.3 22.76,63.4 | 22.76,63.4 22.86,57.2 22.86,53.34 22.86,46.33 22.86,45.97 20.12,43.23 20.12,42.27 20.12,25.76 22.66,23.22 69.55,23.22 71.73,25.4 71.73,71.53 70.05,73.2 69.24,73.2 | 27.64,63.4 28.65,63.4 30.68,61.37 | 27.64,63.4 22.76,63.4 | v27.43,64.11 27.43,63.6 27.64,63.4 | 69.24,73.2 44.2,73.2 42.62,71.63 39.01,71.63 38.81,71.42 37.44,71.42 36.32,72.54 27.84,72.54 23.37,77.01 v22.2,75.79 | 69.24,73.2 67.26,71.22 67.26,70.26 3.3/2.5/1.1/GND.3
  Bottom 0.2: 31.98,47.97 30.98,46.97 v24.25,46.97 | 31.98,51.97 27.48,56.47 v23.55,56.47
  Bottom 0.25: v34.98,47.97 31.98,47.97 | v34.98,51.97 31.98,51.97
  Bottom 0.305: C2.2 45.52,49.43 v46.98,47.97 | C3.2 42.45,47.13 41.86,46.53 41.86,46.09 v41.98,45.97
  Bottom 0.61: v27.43,64.11 27.94,63.6 C1.2 30.33,63.6 31.97,61.96 C8.2
  pour Route2 (isolate 0.254): 40.69,51.82 46.99,51.82 46.99,45.77 40.23,45.77 40.23,51.77
2V5  (via drill 0.25, 0.25 pad 0.46, 0.5, 0.6)
  Top 0.2: 31.98,44.97 26.48,39.47 v25.18,39.47 | 53.98,51.97 62.73,60.72 v64.38,60.72 | 31.98,48.97 v26.49,48.97 | 49.98,59.97 58.73,68.72 v58.73,70.27 | 34.48,59.97 26.73,67.72 v26.73,70.27
  Top 0.203: U$1.A3 v33.98,58.98 | v26.73,70.27 v26.72,70.28 26.72,70.97 25.35,72.34 v25.4,72.64 | v64.38,60.72 66.46,60.72 v68.22,62.48 | U$1.W18 49.5,41.47 49.99,41.96 v49.99,42.96 v49.98,42.97
  Top 0.25: U$1.T3 33.98,44.97 31.98,44.97 | U$1.U18 v49.98,42.97 | U$1.H19 50.98,51.97 53.98,51.97 | U$1.M3 33.98,48.97 31.98,48.97 | U$1.F4 v34.98,54.97 | U$1.T5 v35.98,44.97 | U$1.W18 v48.98,40.97 | U$1.D18 49.98,56.97 49.98,59.97 | U$1.D11 v42.98,56.97 | U$1.W13 v43.98,40.97 | U$1.E6 v37.98,55.97 | U$1.W7 v37.98,40.97 | U$1.A3 34.48,59.97
  Top 0.305: 33.98,44.97 v35.98,44.97
  Top 0.406: 2.5V.4 16.23,85.06 17.2,86.03
  Top 0.61: 19.55,83.53 C25.1 | C5.2 21.79,60.76 23.98,62.94 23.98,64.21 23.57,64.62 v22.55,64.62 20.42,66.75 20.42,72.54 23.27,75.39 23.27,76.71 22.91,77.06 22.91,82.5 22.25,83.16 22.25,83.21 22,83.46 21.95,83.46 21.43,83.98 C25.1 | v69.24,29.26 67.12,29.26 C4.2 | 17.05,86.24 L2.2 17.05,86.17 17.2,86.03 19,84.23 19.76,84.23 C25.1
  Route15 0.203: v26.49,48.97 20.98,48.97 | v33.98,58.98 33.98,57.96 34.16,57.78 | v58.73,70.27 58.73,70.26 58.73,70.92 58.12,71.53 | v42.98,56.97 42.85,56.97 | 19.76,42.22 22.5,39.47 v25.18,39.47 | v37.98,40.97 37.92,40.97 37.44,41.45 36.47,41.45 35.46,42.47 35.46,44.45 v35.98,44.97 | v43.98,40.97 43.87,40.97 43.43,41.4 43.43,48.46 43.46,48.49 | 49,40.97 v48.98,40.97 48.98,41.04 | 49.94,42.93 v49.98,42.97 | v68.22,62.48 68.22,67.72 68.07,67.87 | v25.4,72.64 26.77,71.78 27.91,72.92 | v26.73,70.27 26.73,70.87 28.55,72.69 | v64.38,60.72 69.02,60.72 71.22,58.52
  Route15 0.305: v34.98,54.97 34.98,56.97 34.62,57.33 | v37.98,55.97 36.06,55.97 36.02,55.93 | 20.98,48.97 19.76,50.19 | 43.46,48.49 48.87,43.08 49.87,43.08 v49.98,42.97
  Route15 0.61: v22.55,64.62 25.3,64.62 26.98,62.94 29.01,62.94 34.16,57.78 34.62,57.33 36.02,55.93 v39.98,51.97 43.46,48.49 | v22.55,64.62 21.13,64.62 19.76,63.25 19.76,50.19 19.76,42.22 19.76,32.16 23.47,28.45 23.47,21.54 26.11,18.9 64.57,18.9 71.22,25.55 71.22,27.28 | 71.22,27.28 71.22,58.52 71.22,64.72 68.07,67.87 66.04,67.87 64.82,69.09 3.3/2.5/1.1/GND.2 63.45,71.53 58.12,71.53 38.1,71.53 36.93,72.69 28.55,72.69 28.14,72.69 27.91,72.92 25.91,74.93 22.76,74.93 22.05,74.22 | 71.22,27.28 v69.24,29.26 | v22.55,64.62 22.45,64.62
  Bottom 0.203: v39.98,51.97 41.45,50.49 42.47,50.49 43.48,51.46 43.48,56.44 42.98,56.95 v42.98,56.97
  Bottom 0.61: C7.2 23.75,40.9 v25.18,39.47 | C6.2 34.63,55.32 v34.98,54.97
3V3  (via drill 0.25, 0.25 pad 0.46, 0.6, 1 pad 0.61)
  Top 0.2: 31.98,54.97 26.48,60.47 v25.18,60.47 | 51.98,37.97 61.73,28.22 v61.73,26.17 | 53.98,53.97 63.73,63.72 v64.38,63.72 | 53.98,57.47 61.73,65.22 v64.98,65.22 | 31.98,45.47 27.48,40.97 v25.78,40.97 | 53.98,54.97 63.23,64.22 v64.98,64.22 | 47.48,59.97 55.73,68.22 v55.73,70.27 | 31.98,51.47 27.98,55.47 v25.18,55.47 | 37.48,59.97 29.23,68.22 v29.23,69.67 | 50.98,59.97 59.23,68.22 v59.23,69.67 | 31.98,55.47 26.48,60.97 v25.78,60.97 | 53.98,45.97 54.23,46.22 v64.98,46.22 | 47.48,37.97 54.23,31.22 v54.23,26.77 | 39.98,59.97 34.23,65.72 v34.23,67.31 | 31.98,41.47 26.98,36.47 v25.18,36.47
  Top 0.203: U$1.W11 U$1.W12 | R3.2 24.11,72.48 v24.13,73.3 | 16.15,61.16 16.15,62.01 SPI.L$2
  Top 0.25: U$1.L6 v36.98,49.97 | U$1.J6 v36.98,51.97 | U$1.F3 33.98,54.97 31.98,54.97 | U$1.AA21 51.98,38.97 51.98,37.97 | U$1.F21 52.98,53.97 53.98,53.97 | U$1.R18 U$1.R19 U$1.R20 v51.98,44.97 | U$1.G7 U$1.F8 U$1.E8 U$1.D8 v39.98,56.97 | U$1.P20 U$1.P21 52.98,45.97 53.98,45.97 | v40.98,40.97 U$1.W10 U$1.W11 | U$1.W15 U$1.W14 U$1.Y13 U$1.Y12 | U$1.T6 v36.98,44.97 | U$1.R8 v38.98,45.97 | U$1.Y8 U$1.Y7 v37.98,39.97 | U$1.C22 53.98,57.47 | U$1.C7 U$1.B8 39.98,58.97 39.98,59.97 | U$1.M19 v50.98,47.97 | U$1.W20 v51.98,40.97 | U$1.AA16 U$1.AB16 47.48,37.97 | U$1.C12 v43.98,57.97 | U$1.U14 v44.98,42.97 | U$1.F11 U$1.E11 v42.98,55.97 | U$1.K18 v49.98,49.97 | U$1.G14 v45.98,53.97 | 31.98,45.47 U$1.R1 U$1.R2 | U$1.D4 v35.98,56.97 | U$1.E18 49.98,54.97 53.98,54.97 | U$1.A16 47.48,59.97 | 31.98,51.47 U$1.J1 U$1.J2 | U$1.U19 v50.98,42.97 | U$1.A6 37.48,59.97 | U$1.D15 U$1.D16 v47.98,56.97 | U$1.B19 50.98,58.97 50.98,59.97 | U$1.H17 v48.98,51.97 | U$1.T11 v41.98,43.97 | U$1.Y4 v34.98,39.97 | v49.98,46.97 U$1.N18 U$1.M17 | U$1.E1 31.98,55.47 | U$1.W6 v36.98,40.97 | U$1.V8 v38.98,41.97 | U$1.W17 v47.98,40.97 | U$1.D14 U$1.C14 v45.98,57.97 | U$1.C10 v41.98,57.97 | U$1.W12 U$1.Y12 | U$1.L20 v51.98,48.97 | U$1.W1 31.98,41.47 | U$1.Y12 v42.98,39.97
  Top 0.254: v38.66,72.54 38.51,72.54 37.9,73.15 37.9,73.3 38,73.41 VIDEODACSA.13 | VIDEODACSA.30 34.83,81.31 v35.1,81.58 35.34,81.35 VIDEODACSA.29 | VIDEODACSA.38 29.54,78.41 28.45,79.5
  Top 0.305: 35.37,85.94 C14.1 35.26,85.99 35.26,86.46 | 11.31,46.2 R2.2 11.75,49.23 R1.2 10.68,51.61 7.92,51.61 3.23,56.31 R9.1 | 11.31,46.2 11.75,45.76 R6.2 | XTL.P$1 75.86,28.55 C38.1 | SPI.8 15.47,60.48 16.15,61.16 | v5.38,31.6 5.38,28.87 R5.2 | JTAG.4 6.84,43.69 8.33,43.69 10.84,46.2 11.31,46.2
  Top 0.406: SDRAM.49 22.32,25.47 v22.35,25.5 | SDRAM.3 10.94,27.87 v11.12,27.69 | v7.93,23.07 v7.92,23.06 SDRAM.9 | v8.23,8.69 8.25,8.67 SDRAM.27 10.61,8.67 C27.1 | 16.05,62.11 SPI.L$2 16.1,62.06 16.1,63.2 15.7,63.6 10.97,63.6 9.79,64.79 R10.1 8.77,65.43 8.53,65.43 7.23,66.74 C30.1 5.27,66.74 v3.66,65.43 | 17.41,67.84 R38.2 17.27,68.68 v17.78,69.39 17.88,69.49 17.88,70.41 17.41,70.88 R39.1 | XTL.P$4 XTL.P$1 | 75.86,28.55 75.38,28.55 v73.97,27.13 | 28.45,79.5 28.45,80.77 | SDRAM.43 22.05,20.67 v22.1,20.62 | 7.32,19.46 7.67,19.1 v7.92,19.1 7.96,19.07 SDRAM.14 | v10.31,30.48 10.62,30.18 10.62,29.46 SDRAM.1
  Top 0.61: 3.3V.4 11.68,90.31 14.24,90.31 L1.2 17.33,90.42 C24.1 17.77,90.22 v24.28,90.22 | C17.1 C18.1 51.17,78.74 v51.61,78.74 | 7.87,23.01 7.01,22.15 7.01,19.76 7.32,19.46 7.32,9.5 8.23,8.59 | C14.1 36.67,85.9 v37.34,86.56 38.05,87.27 C16.1 | R25.2 22.35,3.84 | 22.35,3.84 23.73,3.84 R24.2 27.67,3.74 R23.2 | v17.59,2.29 20.8,2.29 22.35,3.84 | 28.45,80.77 v28.6,80.92 27.85,81.68 C15.1
  Top 0.66: U$2.4 125.17,20.84 v125.17,24.28
  Route2 0.203: 23.67,52.02 25.63,51.97 v25.78,51.97
  Route2 0.305: v5.38,31.6 5.38,31.9 5.99,32.51 | 21.23,51.82 20.83,51.41
  Route2 0.406: v22.35,25.5 22.35,25.3 22.55,25.09 | v10.31,30.48 10.31,30.79 10.36,30.84 | v11.12,27.69 11.12,27.33 | v7.92,23.06 7.32,23.06 | v8.23,8.69 8.13,8.69 7.82,8.99 | v22.1,20.62 22.4,20.32 22.45,20.32 | v35.1,81.58 35.2,81.58 35.41,81.79 | v38.66,72.54 38.66,72.44 38.51,72.29 | 28.04,76.66 28.09,76.71 | v3.66,65.43 4.37,66.04 3.86,65.53 | v73.97,27.13 73.86,27.13 73.25,26.52
  Route2 0.61: v51.61,78.74 49.38,77.62 49.99,78.23 | 22.05,90.98 22.96,90.07 | v54.76,61.16 55.12,61.16 54.76,60.4 | 54.36,62.99 54.25,62.89 | v30.43,38.15 31.45,39.01 31.85,39.42 | v57.66,34.8 57.76,34.65 57.25,35.15 | v7.92,19.1 7.57,19.1
  Route2 0.66: v125.17,24.28 124.56,26.01 124.36,26.01
  Route15 0.61: v37.34,86.56 38.05,86.56
  Bottom 0.2: 31.98,49.97 29.98,51.97 v25.78,51.97 | 35.98,59.97 27.73,68.22 v27.73,70.27 | 34.98,37.97 24.73,27.72 v24.73,26.17
  Bottom 0.203: 25.73,52.02 v25.78,51.97
  Bottom 0.25: v36.98,49.97 31.98,49.97 | v35.98,56.97 35.98,59.97 | v34.98,39.97 34.98,37.97
  Bottom 0.61: 50.67,57.17 50.67,57.37 50.77,57.27 50.8,57.3 51.46,57.3 51.39,57.37 C9.1 | C9.1 51.38,57.37 v54.76,61.16 | C12.1 56.34,62.08 v56.9,62.59 | v30.43,38.15 30.75,38.22 C11.1 28.61,37.18 27.69,37.18 26.47,35.96 C29.1 | C28.1 56.25,38.69 57.91,37.03 v57.66,34.8 | C9.1 53.55,57.37 C10.1
  pour Route2 (isolate 0.152, rank 6): 0.51,99.57 149.5,99.57 149.5,0.2 0.51,0.3 0.51,1.22 0.41,1.22 0.41,96.62
5V0  (via drill 0.6, 1)
  Top 0.254: HDMI.18 66.44,93.06 v67.26,93.88
  Top 0.406: USB.B.VBUS 57.99,3.71 55.59,1.32 | ADC.1 12.5,69.86 | 12.5,69.86 C39.1 | 12.5,69.86 12.87,69.86 14.02,71.02 14.02,72.85 13.61,73.25 11.79,73.25 9.65,71.12 9.65,69.19 9.25,68.78 | USB.A.VBUS 34.71,3.42 32.51,1.22 | 6.25,79.46 6.29,79.46 8.08,77.67 1.1V.1 9.8,77.67 10.26,77.22 10.26,74.07 8.21,72.02 R30.1
  Top 0.61: C22.1 2.5V.1 | 8.87,92.66 3.3V.1 10.1,93.87 10.1,96.58 | 1.57,64.82 1.57,85.39 3.12,86.94 3.23,86.94 3.23,87.6 1.83,89 C21.1 1.83,97.54 3.05,98.75 7.92,98.75 10.1,96.58 | 1.57,64.82 1.57,20.22 3.56,18.24 3.56,9.04 4.37,8.23 6.6,8.23 8.74,6.1 8.74,2.74 10.26,1.22 32.51,1.22 33.44,1.22 33.54,1.32 55.59,1.32 86.67,1.32 91.44,6.1 95.28,6.1 PS/2.4 | R7.1 5.4,81.01 6.25,80.16 6.25,79.46 C23.1 6.03,79.1 | R30.1 8.38,70.66 8.38,70.36 6.81,68.78 | 9.25,68.78 6.81,68.78 | 6.81,68.78 5.54,68.78 1.57,64.82 | v24.28,93.07 22.86,95 22.76,95.1 11.58,95.1 10.1,96.58
  Top 0.66: 3.23,86.94 C22.1
  Route2 0.61: 103.35,67.4 GPIO_A.11
  Route15 0.61: 123.77,67.23 GPIO_B.11 122.42,67.23 120.57,69.08 120.57,82.56 119.28,83.85 | 102.61,67.23 GPIO_A.11 102.54,67.23 101.4,68.38 101.4,80.26 | GPIO_C.11 143.15,67.23 141.4,68.98 141.4,80.47 | 141.4,80.47 141.4,80.76 | 101.4,80.26 102.62,81.48 112.27,81.48 114.63,83.85 119.28,83.85 | 101.4,80.26 101.4,80.67 96.83,85.24 v96.83,93.17 | 119.28,83.85 138.02,83.85 141.4,80.47
  Bottom 0.61: 64.92,98.96 95.3,98.96 96.83,97.43 v96.83,93.17 | 64.92,98.96 42.06,98.96 37.08,93.98 31.29,93.98 30.38,94.89 26.42,94.89 24.59,93.07 v24.28,93.07 22.86,91.64 22.86,79.86 24.66,78.06 POWER_SW.P$3 | v67.26,93.88 67.26,96.62 64.92,98.96
5V0FAST
  Top 0.61: C31.1 3.22,69.09 4.37,69.09 5.94,70.66 R30.2 6.35,70.7 6.35,71.68 7.98,73.3 7.98,75.39 arc-90 8.38,75.79 1.1V.3
5V0SLOW  (via drill 0.6)
  Top 0.61: v9.04,82.8 9.04,84.85 2.5V.3 | R7.2 8.59,82.35 v9.04,82.8 | 3.3V.3 v8.88,89.67 v8.89,89.66 | C32.2 9.25,83.01 v9.04,82.8
  Bottom 0.61: v8.89,89.66 8.94,82.91 v9.04,82.8
A0  (via drill 0.25 pad 0.46)
  Top 0.203: SDRAM.23 12.53,11.87 17.02,16.36 17.02,30.84 22.25,36.07 22.25,40.23 24.49,42.47 v25.17,42.47 v25.18,42.47
  Top 0.25: U$1.R6 v36.98,45.97
  Route2 0.2: 31.98,45.47 28.98,42.47 v25.18,42.47
  Route2 0.25: v36.98,45.97 36.48,45.47 31.98,45.47
A1  (via drill 0.25 pad 0.46)
  Top 0.203: SDRAM.24 12.34,11.07 17.48,16.2 17.48,30.63 22.66,35.81 22.66,39.78 24.28,41.4 25.11,41.4 v25.18,41.47
  Top 0.25: U$1.R5 v35.98,45.97
  Bottom 0.2: 31.98,45.47 27.98,41.47 v25.18,41.47
  Bottom 0.25: v35.98,45.97 35.48,45.47 31.98,45.47
A2  (via drill 0.25 pad 0.46)
  Top 0.203: SDRAM.25 12.15,10.27 17.93,16.05 17.93,30.53 23.06,35.66 23.06,38.66 24.43,40.03 25.72,40.03 v25.78,39.97
  Top 0.25: U$1.T7 v37.98,44.97
  Bottom 0.2: 31.98,44.47 27.48,39.97 v25.78,39.97
  Bottom 0.25: v37.98,44.97 37.48,44.47 31.98,44.47
A3  (via drill 0.25 pad 0.46)
  Top 0.203: v25.18,38.47 24.69,38.47 23.47,37.25 23.47,35.51 18.34,30.38 18.34,15.85 11.94,9.45 9.87,9.45 SDRAM.26
  Top 0.25: U$1.U6 v36.98,43.97
  Bottom 0.2: 31.98,43.97 26.48,38.47 v25.18,38.47
  Bottom 0.25: v36.98,43.97 31.98,43.97
A4  (via drill 0.25 pad 0.46)
  Top 0.203: SDRAM.29 24,9.47 36.73,22.2 v36.73,26.17
  Top 0.25: U$1.Y10 v40.98,39.97
  Bottom 0.2: 40.98,37.97 36.73,33.72 v36.73,26.17
  Bottom 0.25: v40.98,39.97 40.98,37.97
A5  (via drill 0.25 pad 0.46)
  Top 0.203: SDRAM.30 24.14,10.27 36.23,22.36 v36.23,26.77
  Top 0.25: U$1.U10 v40.98,42.97
  Route2 0.2: 41.48,37.97 36.23,32.72 v36.23,26.77
  Route2 0.25: v40.98,42.97 41.48,42.47 41.48,37.97
A6  (via drill 0.25 pad 0.46)
  Top 0.203: SDRAM.31 24.38,11.07 35.87,22.55 35.87,26.03 v35.73,26.17
  Top 0.25: U$1.T10 v40.98,43.97
  Route15 0.2: 41.48,37.97 35.73,32.22 v35.73,26.17
  Route15 0.25: v40.98,43.97 41.48,43.47 41.48,37.97
A7  (via drill 0.25 pad 0.46)
  Top 0.2: 39.98,37.97 34.73,32.72 v34.73,26.17
  Top 0.203: SDRAM.32 24.11,11.87 34.73,22.48 v34.73,26.17
  Top 0.25: U$1.AA9 39.98,38.97 39.98,37.97
A8  (via drill 0.25 pad 0.46)
  Top 0.203: SDRAM.33 24.4,12.67 34.23,22.49 v34.23,26.77
  Top 0.25: U$1.W9 v39.98,40.97
  Bottom 0.2: 40.48,37.97 34.23,31.72 v34.23,26.77
  Bottom 0.25: v39.98,40.97 40.48,40.47 40.48,37.97
A9  (via drill 0.25 pad 0.46)
  Top 0.203: SDRAM.34 24.69,13.47 33.73,22.5 v33.73,26.17
  Top 0.25: U$1.Y9 v39.98,39.97
  Bottom 0.2: 39.98,37.97 33.73,31.72 v33.73,26.17
  Bottom 0.25: v39.98,39.97 39.98,37.97
A10  (via drill 0.25 pad 0.46)
  Top 0.203: SDRAM.22 12.62,12.67 16.56,16.61 16.56,30.99 21.79,36.22 21.79,40.69 24.07,42.97 v25.78,42.97
  Top 0.25: U$1.R7 v37.98,45.97
  Route15 0.2: 31.98,45.47 29.48,42.97 v25.78,42.97
  Route15 0.25: v37.98,45.97 37.48,45.47 31.98,45.47
A11  (via drill 0.25 pad 0.46)
  Top 0.203: SDRAM.35 24.94,14.27 33.23,22.56 v33.23,26.77
  Top 0.25: U$1.V9 v39.98,41.97
  Route2 0.2: 40.48,37.97 33.23,30.72 v33.23,26.77
  Route2 0.25: v39.98,41.97 40.48,41.47 40.48,37.97
A12  (via drill 0.25 pad 0.46)
  Top 0.203: SDRAM.36 25.18,15.07 32.73,22.62 v32.73,26.17
  Top 0.25: U$1.T9 v39.98,43.97
  Route15 0.2: 40.48,37.97 32.73,30.22 v32.73,26.17
  Route15 0.25: v39.98,43.97 40.48,43.47 40.48,37.97
AUDIO_IN  (via drill 0.6)
  Top 0.203: ADC.3 12.5,65.84 v11.79,65.13
  Bottom 0.203: v11.79,65.13 6.2,65.13 JP1.1
AUDIO_LEFT  (via drill 0.25 pad 0.46)
  Top 0.203: v44.23,67.31 44.23,70.74 45.11,71.63 45.11,74.98 45.72,75.59 50.39,75.59 54.25,79.45 78.54,79.45 81.18,82.09 93.17,82.09 94.79,83.72 98.75,83.72 100.08,85.04 105.97,85.04 106.88,85.95 106.88,86.46 107.39,86.97 111.96,86.97 112.58,87.58 R28.2
  Top 0.25: U$1.J11 v42.98,51.97
  Route15 0.2: 44.23,65.99 v44.23,67.31
  Route15 0.203: 44.23,65.99 42.48,64.24 42.48,52.47
  Route15 0.25: v42.98,51.97 42.48,52.47
AUDIO_RIGHT  (via drill 0.25 pad 0.46)
  Top 0.2: 43.48,59.97 44.73,61.22 v44.73,70.27
  Top 0.203: v44.73,70.27 44.73,70.53 45.52,71.32 45.52,74.88 45.82,75.18 50.6,75.18 54.46,79.05 78.74,79.05 81.38,81.69 93.47,81.69 95.1,83.31 98.96,83.31 100.28,84.63 106.98,84.63 108.04,85.68 R29.2
  Top 0.25: U$1.A12 43.48,59.97
BA0  (via drill 0.25 pad 0.46)
  Top 0.203: SDRAM.20 12.9,14.27 15.6,16.97 15.6,31.34 20.93,36.68 20.93,42.77 23.67,45.52 25.13,45.52 v25.18,45.47
  Top 0.25: U$1.P7 v37.98,46.97
  Route2 0.2: 31.98,46.47 30.98,45.47 v25.18,45.47
  Route2 0.25: v37.98,46.97 37.48,46.47 31.98,46.47
BA1  (via drill 0.25 pad 0.46)
  Top 0.203: SDRAM.21 12.76,13.47 16.1,16.82 16.1,31.19 21.34,36.42 21.34,42.27 23.54,44.47 v25.18,44.47
  Top 0.25: U$1.P6 v36.98,46.97
  Bottom 0.2: 31.98,46.47 29.98,44.47 v25.18,44.47
  Bottom 0.25: v36.98,46.97 36.48,46.47 31.98,46.47
CAS_N  (via drill 0.25 pad 0.46)
  Top 0.203: SDRAM.17 13.01,16.67 14.22,17.88 14.22,32.05 19.56,37.39 19.56,43.84 23.19,47.47 | 23.19,47.47 23.22,47.5 | v25.18,47.47 23.19,47.47
  Top 0.25: U$1.N8 v38.98,47.97
  Route2 0.2: 31.98,47.47 v25.18,47.47
  Route2 0.25: v38.98,47.97 38.48,47.47 31.98,47.47
CKE  (via drill 0.25 pad 0.46)
  Top 0.2: 39.48,37.97 32.23,30.72 v32.23,29.21
  Top 0.203: SDRAM.37 25.21,15.87 32.23,22.88 v32.23,29.21
  Top 0.25: U$1.AB8 39.48,37.97
CONF_DONE  (via drill 0.25 pad 0.46, 0.6)
  Top 0.203: v16.26,49.48 15.48,48.46 R2.1
  Top 0.25: U$1.K6 v36.98,50.97
  Bottom 0.2: 31.98,50.97 28.48,54.47 v25.18,54.47
  Bottom 0.203: v25.18,54.47 21.7,54.47 16.71,49.48 v16.26,49.48
  Bottom 0.25: v36.98,50.97 31.98,50.97
CONFIG_N  (via drill 0.25, 0.25 pad 0.46, 0.6)
  Top 0.2: 35.48,59.97 27.23,68.22 v27.23,69.67
  Top 0.203: v27.23,69.67 27.23,70.71 | 27.23,70.71 27.23,71.12 26.82,71.53 26.82,72.49 25.25,74.07 23.47,74.07 | 23.47,74.07 23.37,74.07 22.25,72.95 22.25,71.05 R3.1 | 27.23,70.72 27.23,70.71 | v23.06,72.75 23.06,73.66 23.47,74.07 | RESET.1 2.44,10.94 v2.44,13.21 1.6,14.04 RESET.2
  Top 0.25: U$1.A4 35.48,59.97
  Bottom 0.203: v23.06,72.75 22.71,72.39 11.73,72.39 6.91,67.56 2.85,67.56 1.63,66.34 1.63,18.49 2.44,17.68 v2.44,13.21
CS_N  (via drill 0.25 pad 0.46)
  Top 0.203: SDRAM.19 13.04,15.07 15.09,17.12 15.09,31.55 20.47,36.93 20.47,42.98 23.47,45.97 v25.78,45.97
  Top 0.25: U$1.P8 v38.98,46.97
  Route15 0.2: 31.98,46.47 31.48,45.97 v25.78,45.97
  Route15 0.25: v38.98,46.97 38.48,46.47 31.98,46.47
DQ0  (via drill 0.25 pad 0.46)
  Top 0.203: SDRAM.2 10.63,28.67 11.18,29.21 11.18,33.43 16.46,38.71 16.46,46.48 23.95,53.97 v26.59,53.97
  Top 0.25: U$1.K7 v37.98,50.97
  Bottom 0.2: 31.98,50.47 28.48,53.97 v26.59,53.97
  Bottom 0.25: v37.98,50.97 37.48,50.47 31.98,50.47
DQ1  (via drill 0.25 pad 0.46)
  Top 0.203: v25.78,54.97 24.29,54.97 16,46.69 16,38.76 9.55,32.31 9.55,30.89 8.53,29.87 8.53,27.38 8.85,27.07 SDRAM.4
  Top 0.25: U$1.K9 v39.98,50.97
  Route2 0.2: 31.98,50.47 27.48,54.97 v25.78,54.97
  Route2 0.25: v39.98,50.97 39.48,50.47 31.98,50.47
DQ2  (via drill 0.25 pad 0.46)
  Top 0.203: SDRAM.5 8.53,26.27 7.98,26.82 7.98,30.02 8.59,30.63 8.59,31.95 15.6,38.96 15.6,47.19 24.38,55.98 25.77,55.98 v25.78,55.97
  Top 0.25: U$1.J7 v37.98,51.97
  Bottom 0.2: 31.98,51.47 27.48,55.97 v25.78,55.97
  Bottom 0.25: v37.98,51.97 37.48,51.47 31.98,51.47
DQ3  (via drill 0.25 pad 0.46)
  Top 0.203: SDRAM.7 8.71,24.67 8.43,24.94 8.43,25.45 7.52,26.36 7.52,30.28 7.98,30.73 7.98,31.95 15.14,39.12 15.14,47.35 24.64,56.84 25.65,56.84 v25.78,56.97
  Top 0.25: U$1.J8 v38.98,51.97
  Route2 0.2: 31.98,51.47 26.48,56.97 v25.78,56.97
  Route2 0.203: 31.98,51.47 32.2,51.47 32.72,50.95 35.97,50.95 36.02,51 36.07,51 36.52,51.46 38.36,51.46 38.41,51.41 38.56,51.56
  Route2 0.25: v38.98,51.97 38.56,51.56 38.48,51.47
DQ4  (via drill 0.25 pad 0.46)
  Top 0.203: SDRAM.8 11.27,23.87 11.63,24.23 11.63,33.33 16.87,38.56 16.87,45.87 23.42,52.43 25.13,52.43 v25.18,52.47
  Top 0.25: U$1.L8 v38.98,49.97
  Route2 0.203: 31.98,49.47 31.97,49.48 31.14,49.48 28.14,52.48 27.89,52.48 27.88,52.47 v25.18,52.47
  Route2 0.25: v38.98,49.97 38.48,49.47 31.98,49.47
DQ5  (via drill 0.25 pad 0.46)
  Top 0.203: SDRAM.10 11.14,22.27 12.09,23.22 12.09,33.17 17.27,38.35 17.27,45.36 23.32,51.41 25.11,51.41 v25.18,51.47
  Top 0.25: U$1.L7 v37.98,49.97
  Bottom 0.2: 31.98,49.47 29.98,51.47 v25.18,51.47
  Bottom 0.25: v37.98,49.97 37.48,49.47 31.98,49.47
DQ6  (via drill 0.25 pad 0.46)
  Top 0.203: SDRAM.11 11.31,21.47 12.5,22.66 12.5,32.97 17.73,38.2 17.73,45.21 23.47,50.95 25.76,50.95 v25.78,50.97
  Top 0.25: U$1.M8 v38.98,48.97
  Route15 0.2: 31,49.44 29.48,50.97 v25.78,50.97
  Route15 0.203: v38.98,48.97 38.47,49.48 38.41,49.48 38.37,49.44 31,49.44
DQ7  (via drill 0.25 pad 0.46)
  Top 0.203: SDRAM.13 11.54,19.87 12.9,21.23 12.9,32.72 18.24,38.05 18.24,45.01 23.62,50.39 25.1,50.39 v25.18,50.47
  Top 0.25: U$1.M7 v37.98,48.97
  Route2 0.203: 31.98,48.47 31.97,48.46 30.68,48.46 28.68,50.47 v25.18,50.47
  Route2 0.25: v37.98,48.97 37.48,48.47 31.98,48.47
DQ8  (via drill 0.25 pad 0.46)
  Top 0.203: v30.73,26.17 30.73,23.36 27.08,19.71 21.54,19.71 21.39,19.86 SDRAM.42
  Top 0.25: U$1.W8 v38.98,40.97
  Bottom 0.2: 38.98,37.97 30.73,29.72 v30.73,26.17
  Bottom 0.25: v38.98,40.97 38.98,37.97
DQ9  (via drill 0.25 pad 0.46)
  Top 0.203: SDRAM.44 22.83,21.47 24.08,20.22 26.87,20.22 30.23,23.57 v30.23,26.77
  Top 0.25: U$1.T8 v38.98,43.97
  Route2 0.2: 39.48,37.97 30.23,28.72 v30.23,26.77
  Route2 0.25: v38.98,43.97 39.48,43.47 39.48,37.97
DQ10  (via drill 0.25 pad 0.46)
  Top 0.2: 38.48,37.97 29.73,29.22 v29.73,26.17
  Top 0.203: v29.73,26.17 29.73,23.78 26.67,20.73 26.47,20.73 26.01,21.18 25.7,21.18 25.4,20.88 25.09,20.88 24.84,20.62 24.54,20.62 23.57,21.59 23.32,21.59 22.96,21.95 22.96,22.2 22.2,22.96 22.15,22.96 21.84,22.66 21.84,22.5 21.59,22.25 20.77,22.25 SDRAM.45
  Top 0.25: U$1.AB7 38.48,37.97
DQ11  (via drill 0.25 pad 0.46)
  Top 0.2: 37.98,37.97 29.23,29.22 v29.23,26.77
  Top 0.203: SDRAM.47 21.8,23.87 24.13,21.54 24.33,21.74 24.79,21.74 25.2,21.34 25.35,21.34 25.76,21.74 26.06,21.74 26.57,21.23 26.62,21.23 26.92,21.54 26.92,21.64 29.23,23.94 v29.23,26.77
  Top 0.25: U$1.AA7 37.98,38.97 37.98,37.97
DQ12  (via drill 0.25 pad 0.46)
  Top 0.203: SDRAM.48 21.66,24.67 24.23,22.1 26.72,22.1 28.75,24.13 28.75,26.14 v28.73,26.17
  Top 0.25: U$1.U7 v37.98,42.97
  Bottom 0.2: 38.48,37.97 28.73,28.22 v28.73,26.17
  Bottom 0.25: v37.98,42.97 38.48,42.47 38.48,37.97
DQ13  (via drill 0.25 pad 0.46)
  Top 0.2: 37.48,37.97 28.23,28.72 v28.23,26.77
  Top 0.203: SDRAM.50 21.85,26.27 22.76,27.18 22.76,28.7 22.91,28.85 23.06,28.85 23.16,28.75 23.16,23.88 24.33,22.71 26.57,22.71 28.23,24.37 v28.23,26.77
  Top 0.25: U$1.AB6 37.48,37.97
DQ14  (via drill 0.25 pad 0.46)
  Top 0.203: SDRAM.51 21.69,27.07 22.15,27.52 22.15,28.6 22.45,28.91 22.45,31.04 22.76,31.34 23.37,31.34 23.57,31.14 23.57,24.23 24.59,23.22 26.31,23.22 27.23,24.13 v27.23,26.77
  Top 0.25: U$1.V6 v36.98,41.97
  Bottom 0.2: 37.48,37.97 27.23,27.72 v27.23,26.77
  Bottom 0.25: v36.98,41.97 37.48,41.47 37.48,37.97
DQ15  (via drill 0.25 pad 0.46)
  Top 0.2: 36.48,37.97 26.73,28.22 v26.73,26.17
  Top 0.203: v26.73,26.17 26.52,25.96 26.52,24.13 26.11,23.72 24.79,23.72 24.03,24.49 24.03,26.62 24.28,26.87 24.28,31.19 23.67,31.8 22.55,31.8 22.05,31.29 22.05,29.11 21.61,28.67 SDRAM.53
  Top 0.25: U$1.AB5 36.48,37.97
GND  (via drill 0.25, 0.25 pad 0.46, 0.6, 1)  (2 unrouted)
  Top 0.2: 52.48,59.97 59.73,67.22 v59.73,70.27 | 31.98,44.47 26.48,38.97 v24.46,38.97 | 40.48,37.97 35.23,32.72 v35.23,29.21 | 50.48,37.97 59.73,28.72 v59.73,26.17 | 31.98,50.47 29.48,52.97 v25.78,52.97 | 48.98,59.97 57.73,68.72 v57.73,70.27 | 31.98,52.47 26.98,57.47 v25.18,57.47 | 53.98,48.97 58.73,53.72 v64.38,53.72 | 31.98,56.47 26.98,61.47 v25.18,61.47 | 31.98,48.47 v25.18,48.47 | 31.98,42.47 26.48,36.97 v25.78,36.97 | 45.98,59.97 50.73,64.72 v50.73,70.27 | 31.98,54.47 26.48,59.97 v25.78,59.97 | 53.98,52.47 62.73,61.22 v64.98,61.22 | 45.48,37.97 48.73,34.72 v48.73,26.17 | 53.98,50.97 62.23,59.22 v64.98,59.22 | 53.98,52.97 64.23,63.22 v64.98,63.22 | 40.98,59.97 36.73,64.22 v36.73,70.27 | 42.48,59.97 41.73,60.72 v41.73,70.27 | 36.98,37.97 27.73,28.72 v27.73,26.17 | 31.98,46.47 28.98,43.47 v25.18,43.47 | 31.98,58.47 28.48,61.97 v25.78,61.97 | 53.98,43.97 56.73,41.22 v64.98,41.22 | 41.98,37.97 40.23,36.22 v40.23,26.77 | 53.98,55.97 62.73,64.72 v64.38,64.72 | 53.98,47.47 55.73,49.22 v64.98,49.22 | 53.98,42.47 59.23,37.22 v64.98,37.22 | 33.48,59.97 26.23,67.22 v26.23,69.67
  Top 0.203: VIDEODACSA.1 31.84,72.2 | VIDEODACSA.31 34.33,80.45 | 26.23,67.22 26.23,70.9 26.01,71.12 25.5,71.12 25.09,70.71 25.09,69.9 24.49,69.29 22.76,69.29 22.25,68.78 22.25,67.71 R8.2 | v30.63,36.73 32.36,38.46 32.46,38.46 U$1.AB1 U$1.AB2 | 31.98,40.47 31.53,40.47 27.03,35.97 v25.78,35.97 | U$1.V1 31.98,42.47 | 42.97,11.45 R20.2 | SPI.4 10.49,55.91 | 9.86,53.66 SPI.L$10 | C33.2 C34.1 136.82,82.84 137.36,82.3 140,82.3 v141.12,83.41 | C19.2 126.67,87.38 C20.1 130.09,86.12 v130.66,85.55
  Top 0.25: U$1.B2 U$1.A2 33.48,59.97 | U$1.H3 U$1.H4 U$1.J5 | U$1.M10 v40.98,48.97 | U$1.A21 52.48,59.97 | 31.98,44.47 U$1.T1 U$1.T2 U$1.U3 U$1.U4 | U$1.AB9 40.48,37.97 | U$1.AB19 50.48,37.97 | 31.98,50.47 U$1.K1 U$1.K2 U$1.L3 U$1.M4 U$1.N5 | U$1.F5 U$1.E4 U$1.E3 U$1.D2 U$1.D1 31.98,56.47 | v40.98,45.97 U$1.P10 U$1.N11 U$1.M12 | U$1.R3 U$1.P2 U$1.P1 31.98,46.47 | U$1.P4 U$1.N3 U$1.M2 U$1.M1 31.98,48.47 | U$1.W4 U$1.W3 U$1.V2 U$1.V1 | v46.98,46.97 U$1.N15 U$1.M14 U$1.L13 | U$1.C17 48.98,57.97 48.98,59.97 | 31.98,52.47 U$1.H1 U$1.H2 U$1.H3 | U$1.F16 v47.98,54.97 | U$1.E13 v44.98,55.97 | U$1.N13 v43.98,46.97 | 31.98,40.47 U$1.Y1 U$1.Y2 | U$1.N17 v48.98,46.97 | v46.98,48.97 U$1.L15 U$1.K14 | U$1.U5 U$1.U4 | U$1.L11 U$1.K12 v43.98,50.97 | U$1.D10 v41.98,56.97 | U$1.L21 52.98,48.97 53.98,48.97 | U$1.C5 U$1.C4 U$1.C3 | U$1.H15 U$1.J15 v46.98,51.94 | U$1.Y18 v48.98,39.97 | U$1.H7 v37.98,52.97 | U$1.H12 v43.98,52.97 | U$1.H3 U$1.J3 U$1.K4 U$1.L5 | U$1.B14 45.98,58.97 45.98,59.97 | 31.98,54.47 U$1.F1 U$1.F2 U$1.G3 U$1.G4 | U$1.H22 53.98,52.47 | U$1.AB14 45.48,37.97 | U$1.G9 v40.98,53.97 | U$1.R13 v43.98,44.97 | U$1.V17 v47.98,41.97 | U$1.U9 v39.98,42.97 | U$1.V12 v42.98,41.97 | U$1.J20 51.98,50.97 53.98,50.97 | U$1.K8 v38.98,50.97 | U$1.G19 50.98,52.97 53.98,52.97 | U$1.B9 40.98,58.97 40.98,59.97 | U$1.A11 42.48,59.97 | U$1.F6 v37.98,54.97 | U$1.AA6 36.98,38.97 36.98,37.97 | U$1.N7 v37.98,47.97 | U$1.C5 U$1.D5 U$1.E5 | U$1.V7 v37.98,41.97 | U$1.B1 31.98,58.47 | U$1.K10 v41.98,50.97 | U$1.C5 v36.98,57.97 | U$1.T16 v46.98,43.97 | U$1.F17 v48.98,53.97 | U$1.T21 52.98,43.97 53.98,43.97 | U$1.AA11 41.98,38.97 41.98,37.97 | U$1.Y5 U$1.AA4 U$1.AA3 U$1.AB2 | U$1.D20 51.98,55.97 53.98,55.97
  Top 0.25: U$1.N22 53.98,47.47 | U$1.V22 53.98,42.47 | U$1.V4 U$1.U4 | U$1.G5 v35.98,53.97
  Top 0.254: 56.61,92.66 57.76,92.66 58.42,92 58.42,90.5 HDMI.2 | HDMI.11 62.94,92.6 62.99,92.66 | HDMI.8 61.44,92.64 61.42,92.66 | HDMI.5 59.94,92.6 59.99,92.66 | HDMI.17 65.94,92.36 65.73,92.56 65.23,92.56 65.13,92.66 | VIDEODACSA.12 37.32,73.32 37.19,73.46 | 32.66,73.46 32.32,73.11 | 32.32,73.11 VIDEODACSA.2 | VIDEODACSA.1 31.84,72.63 32.32,73.11 | 37.39,74.62 37.62,74.39 VIDEODACSA.15 | VIDEODACSA.14 38.67,73.86 37.39,73.86 | 39.32,79.76 39.22,79.65 37.34,79.65 37.32,79.67 VIDEODACSA.25 | VIDEODACSA.27 36.32,79.05 | VIDEODACSA.26 36.84,79.05 36.83,79.05 | VIDEODACSA.33 33.33,79.1 | VIDEODACSA.31 34.33,79.16 34.39,79.1 | VIDEODACSA.40 30.49,77.37 31.95,77.37 | VIDEODACSA.39 30.49,77.88 31.95,77.88
  Top 0.305: ZD2.1 99.77,12.38 | VIDEODACSA.14 38.59,73.89 | v79.15,32.82 80.94,31.02 XTL.P$2 80.94,28.48 C38.2 | 10.49,55.91 9.86,55.27 9.86,53.66 | 7.82,57.81 11.79,57.81 12.29,57.3 12.29,56.59 11.68,55.98 10.62,55.98 SPI.4 | v5.28,18.59 5.28,16.33 RESET.4 RESET.3
  Top 0.406: SDRAM.6 10.94,25.47 11.18,25.7 11.18,26.42 v11.12,26.42 | SDRAM.46 19.91,23.07 19.15,23.82 | SDRAM.41 19.9,19.07 v19.15,19.81 19.15,19.96 19.05,19.86 | 18.49,9.45 v18.49,9.5 | 36.02,79.1 34.39,79.1 33.33,79.1 32.51,79.1 32.11,78.69 | 36.02,79.1 36.12,79.1 | 36.02,79.1 36.07,79.05 36.32,79.05 36.83,79.05 36.88,79.05 37.29,78.64 37.29,74.73 37.39,74.62 37.39,73.86 37.39,73.46 37.19,73.46 32.66,73.46 | USB.B.GND 66.65,10.7 66.92,10.97 66.92,11.45 R21.2 | 7.82,57.81 5.03,60.6 JP1.2 6.2,62.59 6.2,64.18 C30.2 | JTAG.10 7.52,36.17 10.36,39.01 11.29,39.01 R4.2 | C39.2 11.92,71.97 10.97,71.02 10.97,69.34 v10.52,68.89 10.52,68.33 11.68,67.16 12.45,67.16 ADC.2 | 42.97,11.45 42.97,10.31 USB.A.GND | R13.1 R12.1 R11.1 48.41,84.68 49.38,83.72 49.38,82.08 C17.2 | HDMI.P$1 56.61,92.66 59.99,92.66 61.42,92.66 62.99,92.66 65.13,92.66 | 19.09,8.67 SDRAM.28 | SDRAM.52 19.22,27.87 19.15,27.94 | 19.46,29.46 SDRAM.54 | SDRAM.12 8.59,20.68 8.53,20.73 v8.03,20.73 | 31.8,93.67 31.9,93.67 32.74,94.51 5V_IN.P$5 | 32.11,78.69 31.95,78.54 31.95,77.88 31.95,77.37 | 30.63,80.89 31.19,80.33 31.19,79.55 32.05,78.69 32.11,78.69 | U$2.6 119.99,20.68 v119.99,17.27 | v122.07,16.2 125.78,16.2 127.46,17.88 127.46,20.63 U$2.3 | C22.2 7.01,85.04 7.92,85.95 8.79,85.95 2.5V.2